# Altium project CPUpipoqueira.PrjPcb
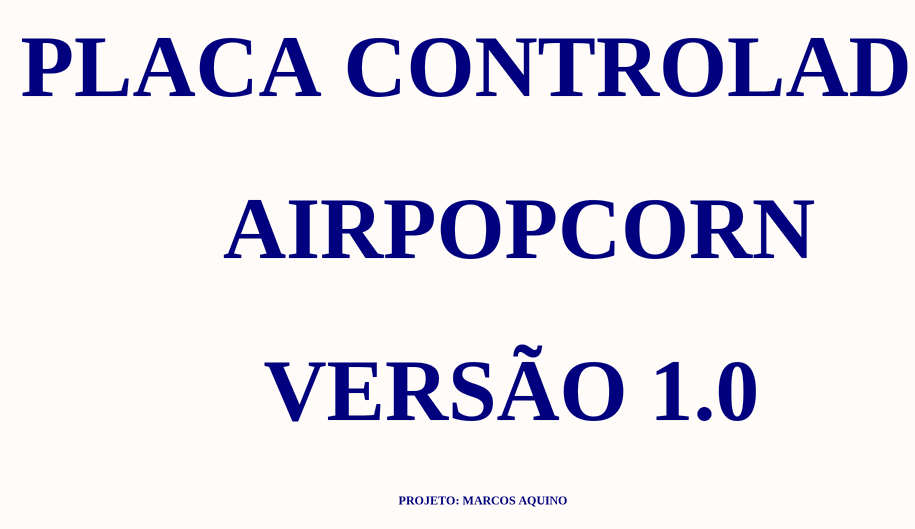
[diagram p0: Capa.SchDoc]
15 sheets, 187 parts. Net scope: global (net labels, ports and power ports of the same name join across sheets).
Board file: CPUpipoqueira.PcbDoc
Sheets:
  Capa.SchDoc
  Regulador.SchDoc
  ControleLeds.SchDoc
  SaidasMotoresCC.SchDoc
  InterfaceConfiguracao.SchDoc
  IHM.SchDoc
  amplificadorAudio.SchDoc
  EntradaSensores.SchDoc
  EntradaSensorTemperatura.SchDoc
  ControlePotencia.SchDoc
  CPU.SchDoc
  Memoria.SchDoc
  JTAG.SchDoc
  InterfaceGSM.SchDoc
  InterfacePagamentos.SchDoc

## Sheet Capa.SchDoc
size A3; DocumentNumber: 1; SheetNumber: 1; SheetTotal: 15

### Notes on the sheet
- PLACA CONTROLADORA
- AIRPOPCORN
- VERSÃO 1.0
- PROJETO: MARCOS AQUINO

## Sheet Regulador.SchDoc: CONTROLADORA AIRPOPCORN
size A3; DocumentNumber: 2; SheetNumber: 2; SheetTotal: 15
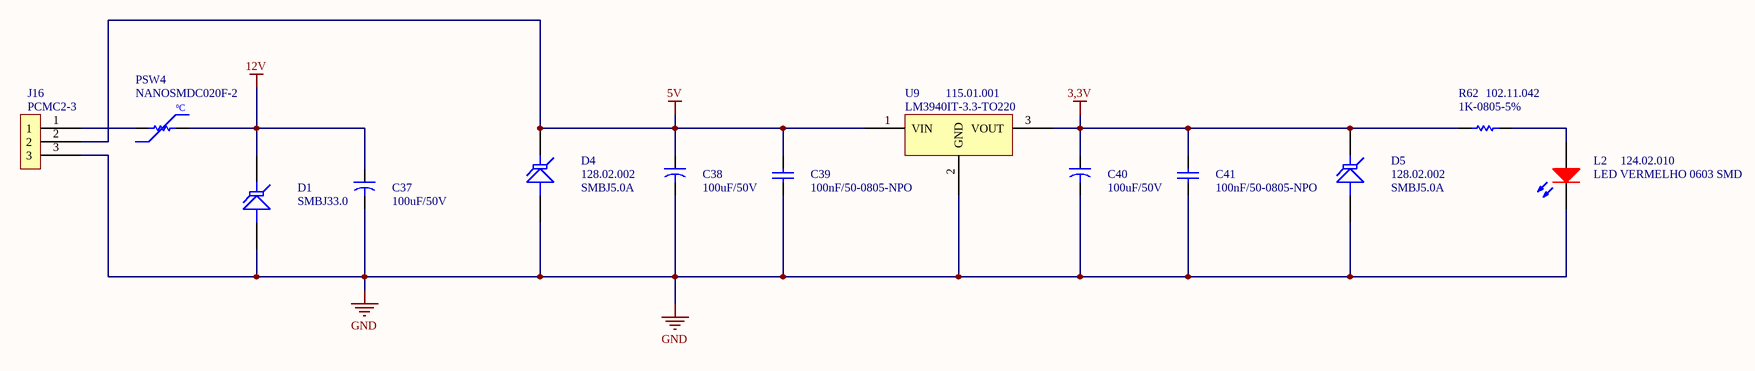
[diagram p1: Regulador.SchDoc]

### Parts
C37  100uF/50V  [CAP POL 8x12mm]
C38  100uF/50V  [CAP POL 8x12mm]
C39  100nF/50-0805-NPO  [0805-REVISADO ONDA]
C40  100uF/50V  [CAP POL 8x12mm]
C41  100nF/50-0805-NPO  [0805-REVISADO ONDA]
D1  SMBJ33.0  [SMB/DO214AA-REVISADO ONDA]
D4  SMBJ5.0A  ERP: 128.02.002  [SMB/DO214AA-REVISADO ONDA]
D5  SMBJ5.0A  ERP: 128.02.002  [SMB/DO214AA-REVISADO ONDA]
J16  PCMC2-3  [CONECTOR HYLOCK 3 VIAS]
L2  LED VERMELHO 0603 SMD  ERP: 124.02.010  [LED 0805 - REVISADO ONDA]
PSW4  NANOSMDC020F-2  [1206-REVISADO ONDA]
R62  1K-0805-5%  ERP: 102.11.042  [0805-REVISADO ONDA]
U9  LM3940IT-3.3-TO220  ERP: 115.01.001  [TO-263]

### Nets
3,3V: C40.1 C41.2 D5.2(K) R62.1 U9.3(VOUT)
5V: C38.1 C39.2 D4.2(K) J16.2 U9.1(VIN)
12V: C37.1 D1.2(K) PSW4.2
GND: C37.2 C38.2 C39.1 C40.2 C41.1 D1.1(A) D4.1(A) D5.1(A) J16.3 L2.2(K) U9.2(GND)
NetJ16_1: J16.1 PSW4.1
NetL2_1: L2.1(A) R62.2

### Notes on the sheet
- NOME
- DATA
- PROJETO
- DESCRIÇÃO
- desenho
- verif.
- aprov.
- TAMANHO
- CODIGO
- Todas as informações disponíveis
- não devem ser divulgadas,
- em parte ou todo.
- CIRCUITO IMPRESSO
- MONTAGEM ELETRÔNICA
- A4
- de
- (in symbol POLYSWITCH 200mA) ºC

### Library data of the parts
D1 = SMBJ5.0A: ERP: 128.02.002
PSW4 = POLYSWITCH 200mA: ERP: 128.12.002
C37 C38 C40 = 100uF/50V: ERP: 105.01.003
C39 C41 = 100nF/50-0805-NPO: ERP: 104.11.005

## Sheet ControleLeds.SchDoc: CONTROLADORA AIRPOPCORN
size A3; DocumentNumber: 3; SheetNumber: 3; SheetTotal: 15
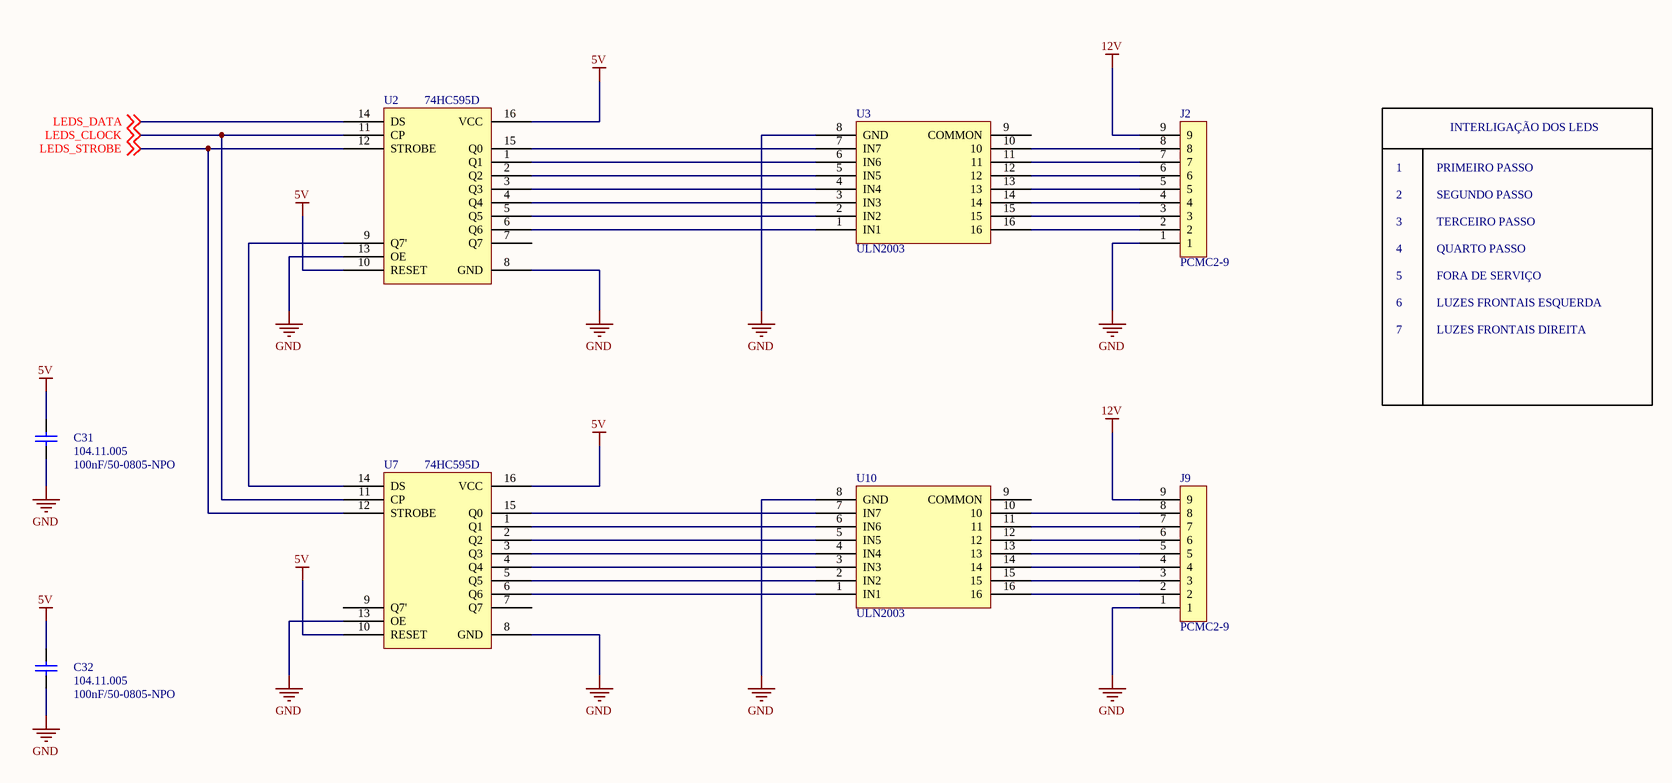
[diagram p2: ControleLeds.SchDoc]

### Parts
C31  100nF/50-0805-NPO  ERP: 104.11.005  [0805-REVISADO ONDA]
C32  100nF/50-0805-NPO  ERP: 104.11.005  [0805-REVISADO ONDA]
J2  PCMC2-9  [PCMC2-9]
J9  PCMC2-9  [PCMC2-9]
U2  74HC595D  [SOIC 16 PINOS]
U3  ULN2003  [SOIC 16 PINOS]
U7  74HC595D  [SOIC 16 PINOS]
U10  ULN2003  [SOIC 16 PINOS]

### Nets
5V: C31.2 C32.2 U2.10(RESET) U2.16(VCC) U7.10(RESET) U7.16(VCC)
12V: J2.9 J9.9
GND: C31.1 C32.1 J2.1 J9.1 U2.8(GND) U2.13(OE) U3.8(GND) U7.8(GND) U7.13(OE) U10.8(GND)
LEDS_CLOCK: U2.11(CP) U7.11(CP) ; off-sheet LEDS_CLOCK
LEDS_DATA: U2.14(DS) ; off-sheet LEDS_DATA
LEDS_STROBE: U2.12(STROBE) U7.12(STROBE) ; off-sheet LEDS_STROBE
NetJ2_2: J2.2 U3.16
NetJ2_3: J2.3 U3.15
NetJ2_4: J2.4 U3.14
NetJ2_5: J2.5 U3.13
NetJ2_6: J2.6 U3.12
NetJ2_7: J2.7 U3.11
NetJ2_8: J2.8 U3.10
NetJ9_2: J9.2 U10.16
NetJ9_3: J9.3 U10.15
NetJ9_4: J9.4 U10.14
NetJ9_5: J9.5 U10.13
NetJ9_6: J9.6 U10.12
NetJ9_7: J9.7 U10.11
NetJ9_8: J9.8 U10.10
NetU2_1: U2.1(Q1) U3.6(IN6)
NetU2_2: U2.2(Q2) U3.5(IN5)
NetU2_3: U2.3(Q3) U3.4(IN4)
NetU2_4: U2.4(Q4) U3.3(IN3)
NetU2_5: U2.5(Q5) U3.2(IN2)
NetU2_6: U2.6(Q6) U3.1(IN1)
NetU2_9: U2.9(Q7') U7.14(DS)
NetU2_15: U2.15(Q0) U3.7(IN7)
NetU7_1: U7.1(Q1) U10.6(IN6)
NetU7_2: U7.2(Q2) U10.5(IN5)
NetU7_3: U7.3(Q3) U10.4(IN4)
NetU7_4: U7.4(Q4) U10.3(IN3)
NetU7_5: U7.5(Q5) U10.2(IN2)
NetU7_6: U7.6(Q6) U10.1(IN1)
NetU7_15: U7.15(Q0) U10.7(IN7)

Not connected (* = marked no-connect by the designer): U2 7(Q7); U3 9(COMMON); U7 7(Q7) 9(Q7'); U10 9(COMMON)

### Notes on the sheet
- INTERLIGAÇÃO DOS LEDS
- 1
- 2
- 3
- PRIMEIRO PASSO
- SEGUNDO PASSO
- TERCEIRO PASSO
- 4
- 5
- QUARTO PASSO
- FORA DE SERVIÇO
- 6
- 7
- LUZES FRONTAIS ESQUERDA
- LUZES FRONTAIS DIREITA
- NOME
- DATA
- PROJETO
- DESCRIÇÃO
- desenho
- verif.
- aprov.
- TAMANHO
- CODIGO
- Todas as informações disponíveis
- não devem ser divulgadas,
- em parte ou todo.
- CIRCUITO IMPRESSO
- MONTAGEM ELETRÔNICA
- A4
- de

### Library data of the parts
U2 U7 = 74HC595D: ERP: CADASTRAR

## Sheet SaidasMotoresCC.SchDoc: CONTROLADORA AIRPOPCORN
size A3; DocumentNumber: 4; SheetNumber: 4; SheetTotal: 15
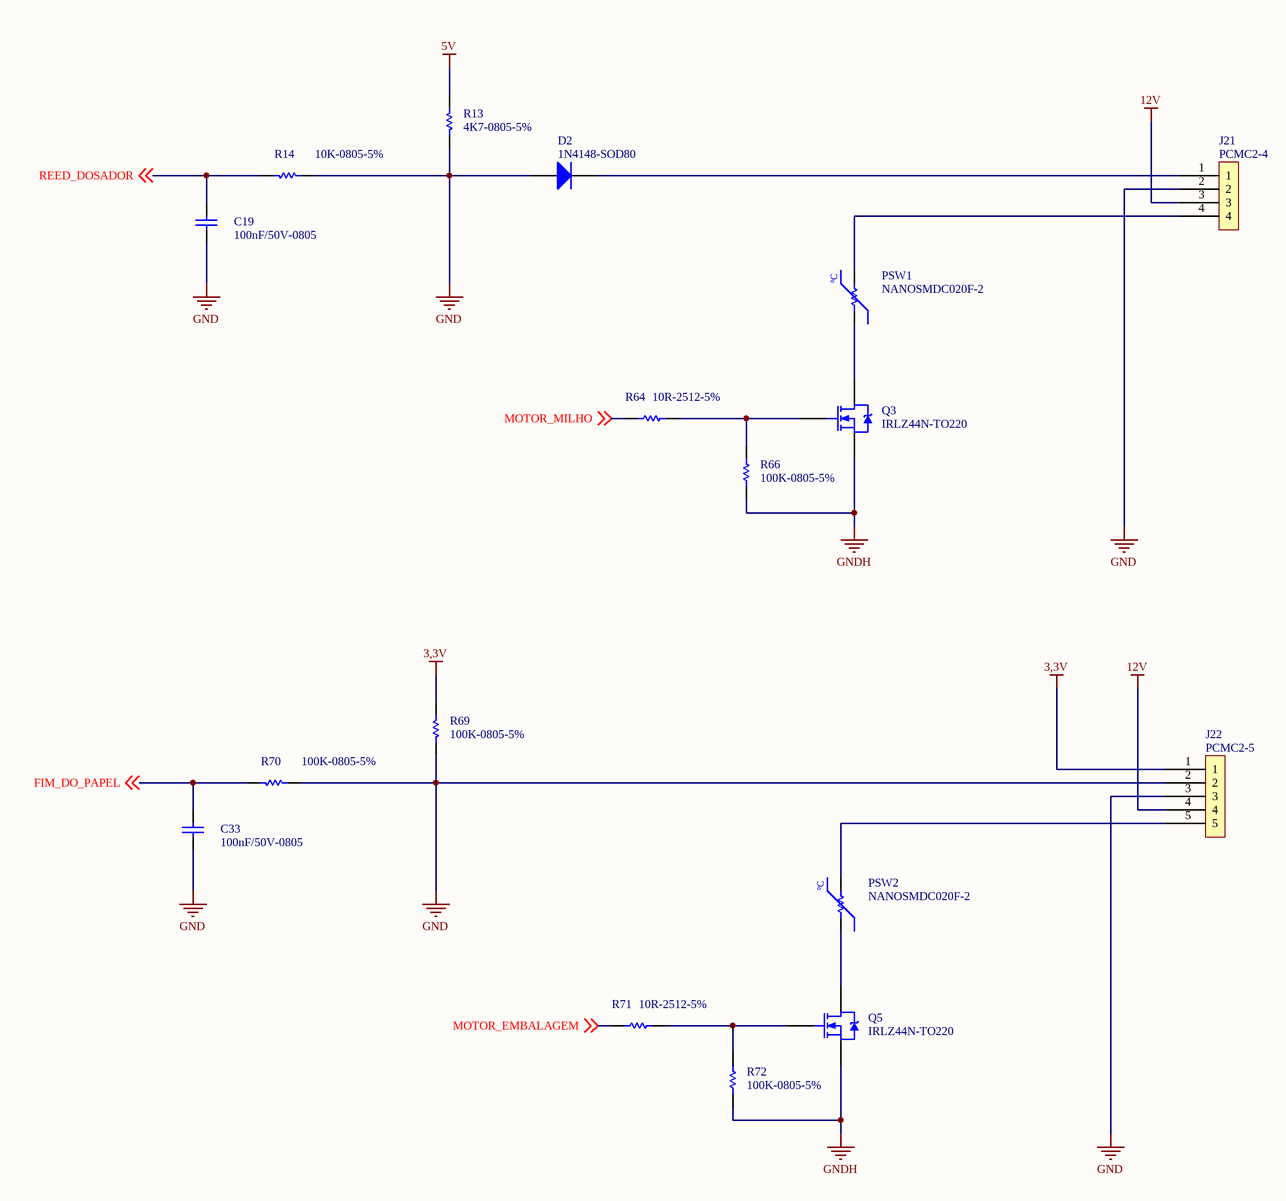
[diagram p3: SaidasMotoresCC.SchDoc]

### Parts
C19  100nF/50V-0805  [0805-REVISADO ONDA]
C33  100nF/50V-0805  [0805-REVISADO ONDA]
D2  1N4148-SOD80
J21  PCMC2-4  [PCMC2-4]
J22  PCMC2-5  [PCMC2-5]
PSW1  NANOSMDC020F-2  [2512 - REVISADO ONDA]
PSW2  NANOSMDC020F-2  [2512 - REVISADO ONDA]
Q3  IRLZ44N-TO220  [TO220-3 EM PÉ]
Q5  IRLZ44N-TO220  [TO220-3 EM PÉ]
R13  4K7-0805-5%  [0805-REVISADO ONDA]
R14  10K-0805-5%  [0805-REVISADO ONDA]
R64  10R-2512-5%  [1206-REVISADO ONDA]
R66  100K-0805-5%  [0805-REVISADO ONDA]
R69  100K-0805-5%  [0805-REVISADO ONDA]
R70  100K-0805-5%  [0805-REVISADO ONDA]
R71  10R-2512-5%  [1206-REVISADO ONDA]
R72  100K-0805-5%  [0805-REVISADO ONDA]

### Nets
3,3V: J22.1 R69.2
5V: R13.2
12V: J21.3 J22.4
GND: C19.1 C33.1 D2.1 J21.2 J22.2 J22.3 R13.1 R14.1 R69.1 R70.1
GNDH: Q3.3(S) Q5.3(S) R66.1 R72.1
FIM_DO_PAPEL: C33.2 R70.2 ; off-sheet FIM_DO_PAPEL
MOTOR_EMBALAGEM: R71.2 ; off-sheet MOTOR_EMBALAGEM
MOTOR_MILHO: R64.2 ; off-sheet MOTOR_MILHO
REED_DOSADOR: C19.2 R14.2 ; off-sheet REED_DOSADOR
NetD2_2: D2.2 J21.1
NetJ21_4: J21.4 PSW1.2
NetJ22_5: J22.5 PSW2.2
NetPSW1_1: PSW1.1 Q3.2(D)
NetPSW2_1: PSW2.1 Q5.2(D)
NetQ3_1: Q3.1(G) R64.1 R66.2
NetQ5_1: Q5.1(G) R71.1 R72.2

### Notes on the sheet
- NOME
- DATA
- PROJETO
- DESCRIÇÃO
- desenho
- verif.
- aprov.
- TAMANHO
- CODIGO
- Todas as informações disponíveis
- não devem ser divulgadas,
- em parte ou todo.
- CIRCUITO IMPRESSO
- MONTAGEM ELETRÔNICA
- A4
- de
- (in symbol POLYSWITCH 200mA) ºC

### Library data of the parts
C19 C33 = 100nF/50-0805-NPO: ERP: 104.11.005
PSW1 PSW2 = POLYSWITCH 200mA: ERP: 128.12.002
R13 R69 = 10K-0805-5%: ERP: 102.11.054
R14 R70 = 1K-0805-5%: ERP: 102.11.042
R64 R71 = 100K-0805-5%: ERP: 102.11.066
D2 = 1N4148-SOD80: ERP: 120.19.001
Q3 Q5 = IRLZ44N-TO220: ERP: 107.01.006
R66 R72 = 100K-0805-5%: ERP: 102.11.066

## Sheet InterfaceConfiguracao.SchDoc: CONTROLADORA AIRPOPCORN
size A3; DocumentNumber: 5; SheetNumber: 5; SheetTotal: 15
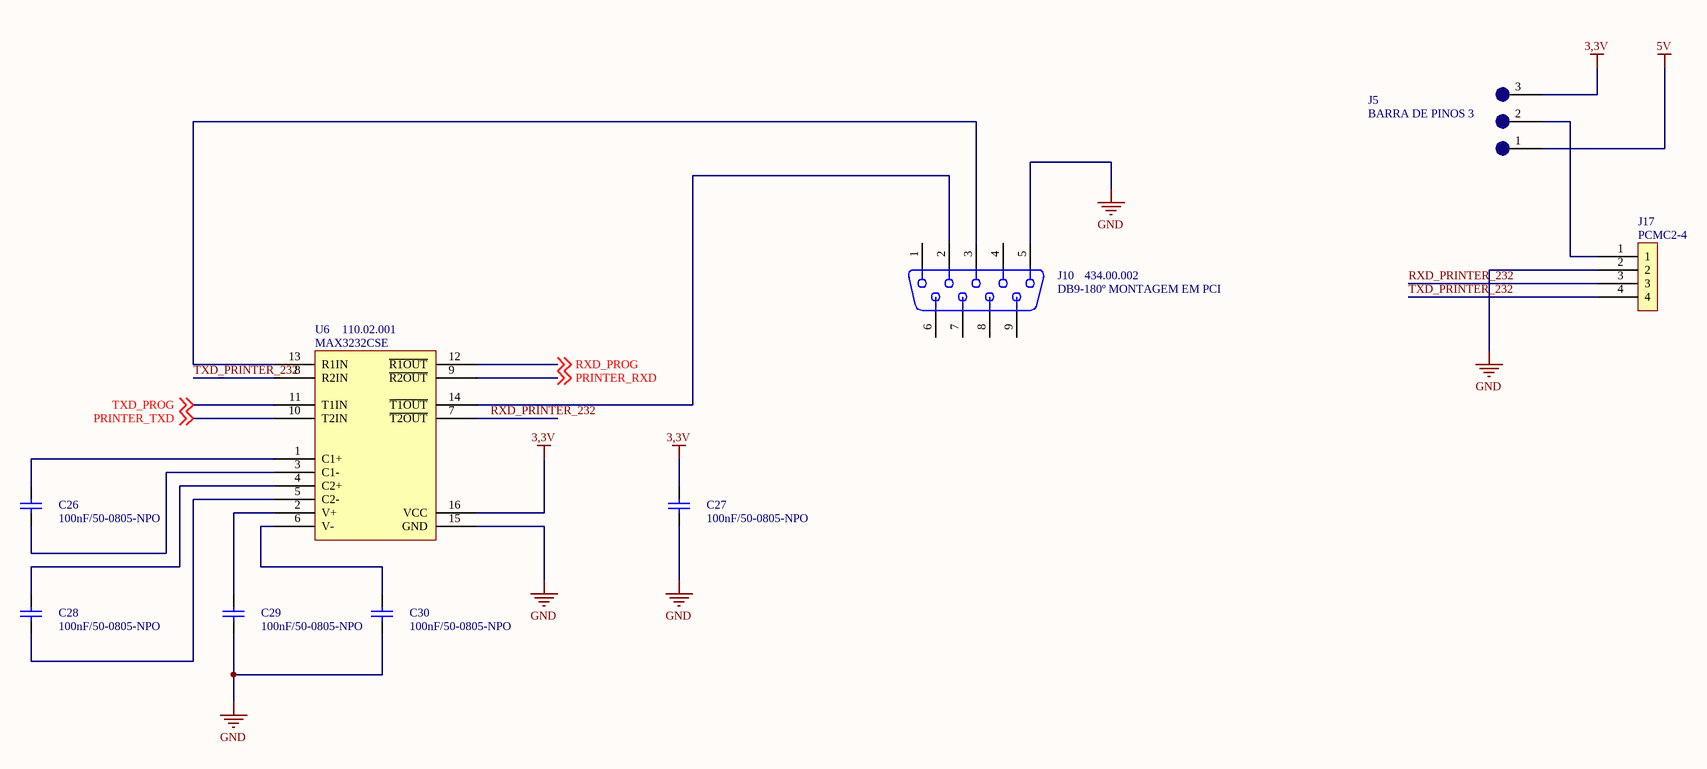
[diagram p4: InterfaceConfiguracao.SchDoc]

### Parts
C26  100nF/50-0805-NPO  [0805-REVISADO ONDA]
C27  100nF/50-0805-NPO  [0805-REVISADO ONDA]
C28  100nF/50-0805-NPO  [0805-REVISADO ONDA]
C29  100nF/50-0805-NPO  [0805-REVISADO ONDA]
C30  100nF/50-0805-NPO  [0805-REVISADO ONDA]
J5  BARRA DE PINOS 3  [JUMPO 3 VIAS]
J10  DB9-180º MONTAGEM EM PCI  ERP: 434.00.002  [DB9-FÊMEA MONTAGEM EM PCI 180]
J17  PCMC2-4  [PCMC2-4]
U6  MAX3232CSE  ERP: 110.02.001  [SOIC 16 PINOS]

### Nets
3,3V: C27.2 J5.3 U6.16(VCC)
5V: J5.1
GND: C27.1 C29.1 C30.1 J10.5 J17.2 U6.15(GND)
PRINTER_RXD: U6.9(~{R2OUT}) ; off-sheet PRINTER_RXD
PRINTER_TXD: U6.10(T2IN) ; off-sheet PRINTER_TXD
RXD_PRINTER_232: J17.3 U6.7(~{T2OUT})
RXD_PROG: U6.12(~{R1OUT}) ; off-sheet RXD_PROG
TXD_PRINTER_232: J17.4 U6.8(R2IN)
TXD_PROG: U6.11(T1IN) ; off-sheet TXD_PROG
NetC26_1: C26.1 U6.3(C1-)
NetC26_2: C26.2 U6.1(C1+)
NetC28_1: C28.1 U6.5(C2-)
NetC28_2: C28.2 U6.4(C2+)
NetC29_2: C29.2 U6.2(V+)
NetC30_2: C30.2 U6.6(V-)
NetJ5_2: J5.2 J17.1
NetJ10_2: J10.2 U6.14(~{T1OUT})
NetJ10_3: J10.3 U6.13(R1IN)

Not connected (* = marked no-connect by the designer): J10 1 4 6 7 8 9

### Notes on the sheet
- NOME
- DATA
- PROJETO
- DESCRIÇÃO
- desenho
- verif.
- aprov.
- TAMANHO
- CODIGO
- Todas as informações disponíveis
- não devem ser divulgadas,
- em parte ou todo.
- CIRCUITO IMPRESSO
- MONTAGEM ELETRÔNICA
- A4
- de

### Library data of the parts
J5 = JUMPER 3
J10 = DB-9 - FÊMEA 180º MONTAGEM EM PCI: DBPCF-09
C26-C30 = 100nF/50-0805-NPO: ERP: 104.11.005

## Sheet IHM.SchDoc: CONTROLADORA AIRPOPCORN
size A3; DocumentNumber: 6; SheetNumber: 6; SheetTotal: 15
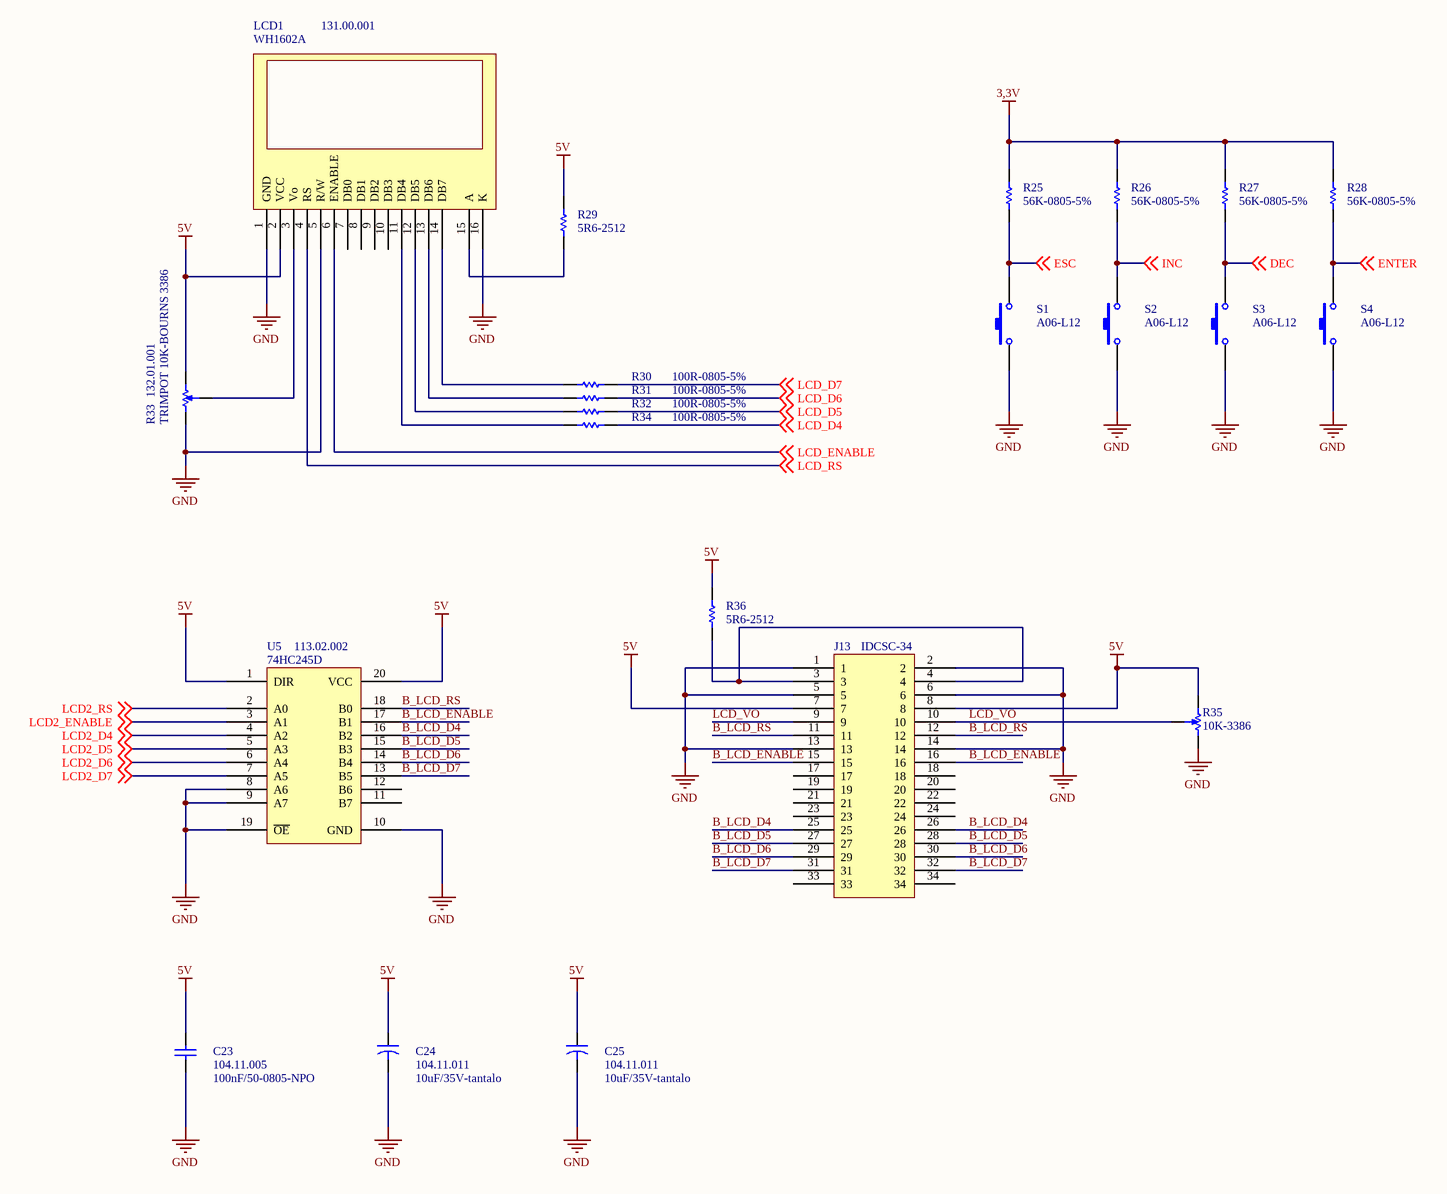
[diagram p5: IHM.SchDoc]

### Parts
C23  100nF/50-0805-NPO  ERP: 104.11.005  [0805-REVISADO ONDA]
C24  10uF/35V-tantalo  ERP: 104.11.011  [CAP 2413 POLARIZADO KEMET]
C25  10uF/35V-tantalo  ERP: 104.11.011  [CAP 2413 POLARIZADO KEMET]
J13  IDCSC-34  [IDCSC-34]
LCD1  WH1602A  ERP: 131.00.001  [WH1602]
R25  56K-0805-5%  [0805-REVISADO ONDA]
R26  56K-0805-5%  [0805-REVISADO ONDA]
R27  56K-0805-5%  [0805-REVISADO ONDA]
R28  56K-0805-5%  [0805-REVISADO ONDA]
R29  5R6-2512  [2512 - REVISADO ONDA]
R30  100R-0805-5%  [0805-revisado onda]
R31  100R-0805-5%  [0805-REVISADO ONDA]
R32  100R-0805-5%  [0805-REVISADO ONDA]
R33  TRIMPOT 10K-BOURNS 3386  ERP: 132.01.001  [TRIMPOT 3386]
R34  100R-0805-5%  [0805-REVISADO ONDA]
R35  10K-3386  [TRIMPOT 3386]
R36  5R6-2512  [2512 - REVISADO ONDA]
S1  A06-L12  [chave tactil nova]
S2  A06-L12  [chave tactil nova]
S3  A06-L12  [chave tactil nova]
S4  A06-L12  [chave tactil nova]
U5  74HC245D  ERP: 113.02.002  [SOIC 20 FEITO A MÃO]

### Nets
3,3V: R25.1 R26.1 R27.1 R28.1
5V: C23.2 C24.1 C25.1 J13.7 J13.8 LCD1.2(VCC) R29.2 R33.1 R35.3 R36.2 U5.1(DIR) U5.20(VCC)
GND: C23.1 C24.2 C25.2 J13.1 J13.2 J13.5 J13.6 J13.13 J13.14 LCD1.1(GND) LCD1.5(R/W) LCD1.16(K) R33.3 R35.1 S1.1 S2.1 S3.1 S4.1 U5.8(A6) U5.9(A7) U5.10(GND) U5.19(~{OE})
B_LCD_D4: J13.25 J13.26 U5.16(B2)
B_LCD_D5: J13.27 J13.28 U5.15(B3)
B_LCD_D6: J13.29 J13.30 U5.14(B4)
B_LCD_D7: J13.31 J13.32 U5.13(B5)
B_LCD_ENABLE: J13.15 J13.16 U5.17(B1)
B_LCD_RS: J13.11 J13.12 U5.18(B0)
DEC: R27.2 S3.2 ; off-sheet DEC
ENTER: R28.2 S4.2 ; off-sheet ENTER
ESC: R25.2 S1.2 ; off-sheet ESC
INC: R26.2 S2.2 ; off-sheet INC
LCD2_D4: U5.4(A2) ; off-sheet LCD2_D4
LCD2_D5: U5.5(A3) ; off-sheet LCD2_D5
LCD2_D6: U5.6(A4) ; off-sheet LCD2_D6
LCD2_D7: U5.7(A5) ; off-sheet LCD2_D7
LCD2_ENABLE: U5.3(A1) ; off-sheet LCD2_ENABLE
LCD2_RS: U5.2(A0) ; off-sheet LCD2_RS
LCD_D4: R34.2 ; off-sheet LCD_D4
LCD_D5: R32.2 ; off-sheet LCD_D5
LCD_D6: R31.2 ; off-sheet LCD_D6
LCD_D7: R30.2 ; off-sheet LCD_D7
LCD_ENABLE: LCD1.6(ENABLE) ; off-sheet LCD_ENABLE
LCD_RS: LCD1.4(RS) ; off-sheet LCD_RS
LCD_VO: J13.9 J13.10 R35.2
NetJ13_3: J13.3 J13.4 R36.1
NetLCD1_3: LCD1.3(Vo) R33.2
NetLCD1_11: LCD1.11(DB4) R34.1
NetLCD1_12: LCD1.12(DB5) R32.1
NetLCD1_13: LCD1.13(DB6) R31.1
NetLCD1_14: LCD1.14(DB7) R30.1
NetLCD1_15: LCD1.15(A) R29.1

Not connected (* = marked no-connect by the designer): J13 17 18 19 20 21 22 23 24 33 34; LCD1 7(DB0) 8(DB1) 9(DB2) 10(DB3); U5 11(B7) 12(B6)

### Notes on the sheet
- NOME
- DATA
- PROJETO
- DESCRIÇÃO
- desenho
- verif.
- aprov.
- TAMANHO
- CODIGO
- Todas as informações disponíveis
- não devem ser divulgadas,
- em parte ou todo.
- CIRCUITO IMPRESSO
- MONTAGEM ELETRÔNICA
- A4
- de

### Library data of the parts
R29 R36 = RES 5R6-CR100: 5R6-CR100; ERP: 103.05.016
R33 = TRIMPOT 3386 50K
R35 = TRIMPOT 10K-3386: TRIMPOT 100K-0805-5%; ERP: 132.01.001
R25-R28 = 56K-0805-5%: ERP: 102.11.063
R30-R32 R34 = 100R-0805-5%: ERP: 102.11.031
S1-S4 = A06-L12: ERP: 136.00.001

## Sheet amplificadorAudio.SchDoc: CONTROLADORA AIRPOPCORN
size A3; DocumentNumber: 7; SheetNumber: 7; SheetTotal: 15
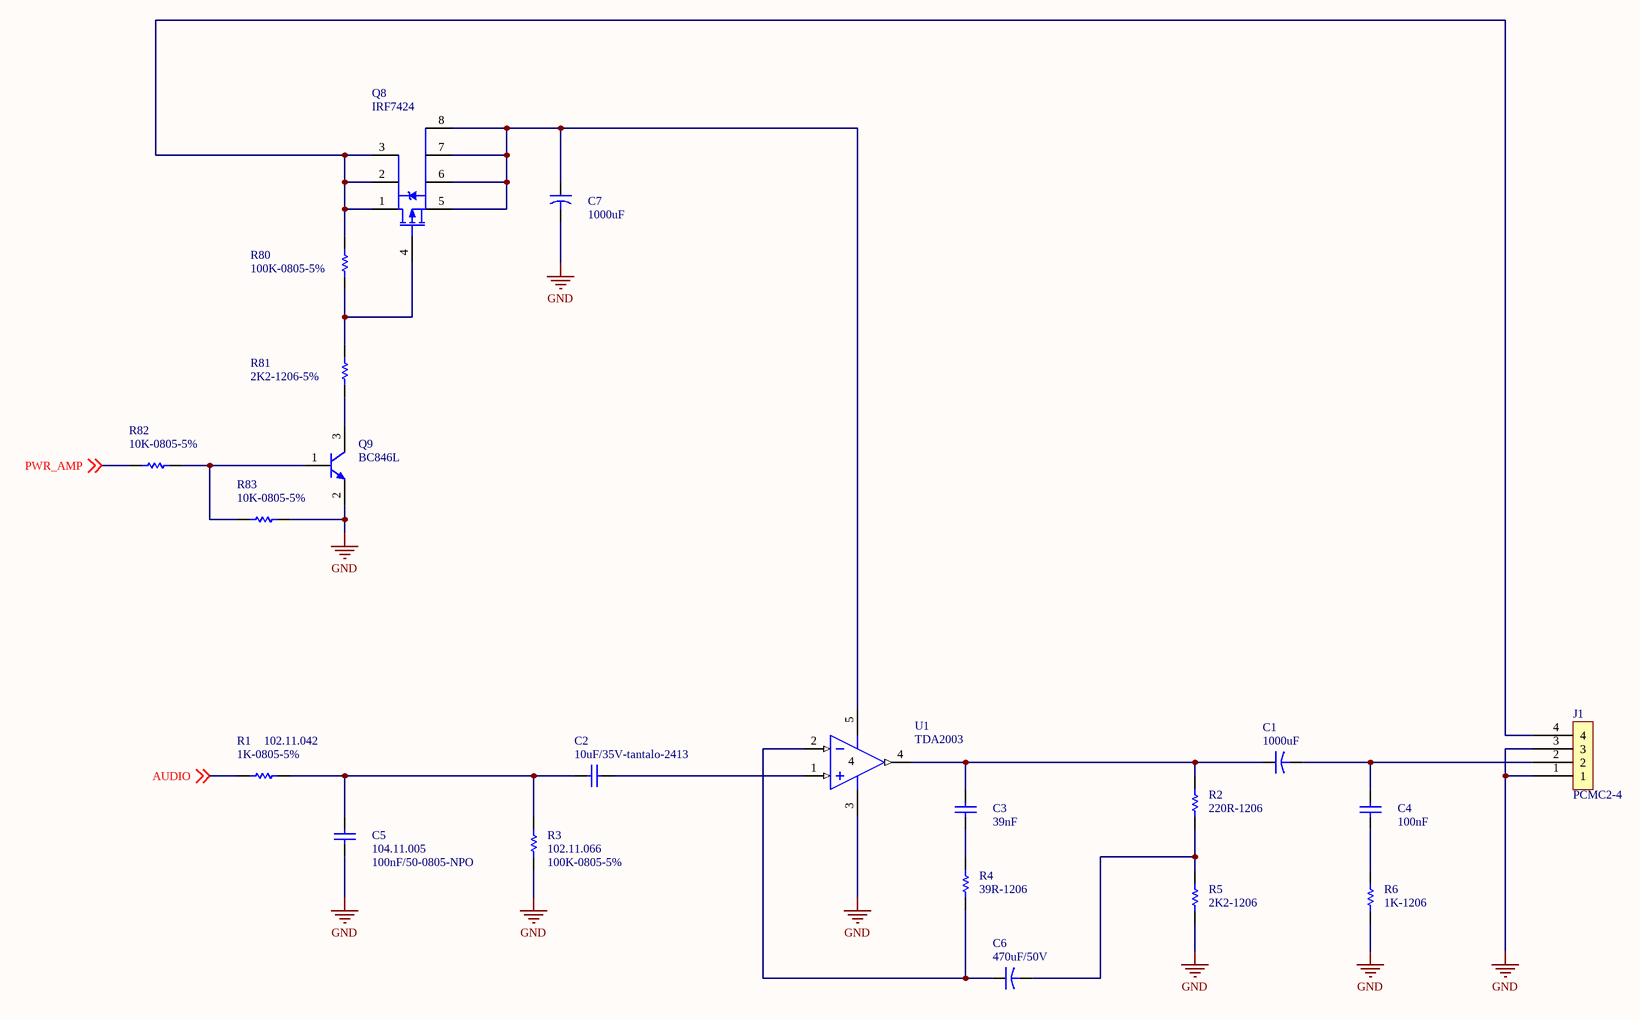
[diagram p6: amplificadorAudio.SchDoc]

### Parts
C1  1000uF  [CAP 10X5]
C2  10uF/35V-tantalo-2413  [CAP POL 5x11mm]
C3  39nF  [1206-REVISADO ONDA]
C4  100nF  [1206-REVISADO ONDA]
C5  100nF/50-0805-NPO  ERP: 104.11.005  [0805-REVISADO ONDA]
C6  470uF/50V  [CAP 10X5]
C7  1000uF  [CAP 10X5]
J1  PCMC2-4  [PCMC2-4]
Q8  IRF7424  [SOIC-08]
Q9  BC846L  [SOT23 - REVISADO ONDA]
R1  1K-0805-5%  ERP: 102.11.042  [0805-REVISADO ONDA]
R2  220R-1206  [1206-REVISADO ONDA]
R3  100K-0805-5%  ERP: 102.11.066  [0805-REVISADO ONDA]
R4  39R-1206  [1206-REVISADO ONDA]
R5  2K2-1206  [1206-REVISADO ONDA]
R6  1K-1206  [1206-REVISADO ONDA]
R80  100K-0805-5%  [0805-REVISADO ONDA]
R81  2K2-1206-5%  [1206-REVISADO ONDA]
R82  10K-0805-5%  [0805-REVISADO ONDA]
R83  10K-0805-5%  [0805-REVISADO ONDA]
U1  TDA2003  [PENTAWATT V]

### Nets
GND: C5.1 C7.2 J1.1 J1.3 Q9.2(E) R3.1 R5.2 R6.2 R83.2 U1.3(GND)
AUDIO: R1.1 ; off-sheet AUDIO
PWR_AMP: R82.1 ; off-sheet PWR_AMP
NetC1_1: C1.1 C3.2 R2.1 U1.4(OUT)
NetC1_2: C1.2 C4.2 J1.2
NetC2_1: C2.1 C5.2 R1.2 R3.2
NetC2_2: C2.2 U1.1(IN+)
NetC3_1: C3.1 R4.1
NetC4_1: C4.1 R6.1
NetC6_1: C6.1 R4.2 U1.2(IN-)
NetC6_2: C6.2 R2.2 R5.1
NetC7_1: C7.1 Q8.5(D2) Q8.6(D2) Q8.7(D2) Q8.8(D2) U1.5(V+)
NetJ1_4: J1.4 Q8.1(S2) Q8.2(S2) Q8.3(S2) R80.2
NetQ8_4: Q8.4(G2) R80.1 R81.2
NetQ9_1: Q9.1(B) R82.2 R83.1
NetQ9_3: Q9.3(C) R81.1

### Notes on the sheet
- NOME
- DATA
- PROJETO
- DESCRIÇÃO
- desenho
- verif.
- aprov.
- TAMANHO
- CODIGO
- Todas as informações disponíveis
- não devem ser divulgadas,
- em parte ou todo.
- CIRCUITO IMPRESSO
- MONTAGEM ELETRÔNICA
- A4
- de

### Library data of the parts
C1 C7 = 470uF/50V: ERP: 105.01.005
C3 C4 = 100nF/50-0805-NPO: ERP: 104.11.005
Q9 = BC846: ERP: 106.22.001
R2 R4-R6 = 390R-2512-5%: ERP: 102.31.002
C6 = 470uF/50V: ERP: 105.01.005
Q8 = IRF7424: ERP: 107.01.012
R3 R80 = 100K-0805-5%
  R80: ERP: 102.11.066
R82 R83 = 10K-0805-5%: ERP: 102.11.054

## Sheet EntradaSensores.SchDoc: CONTROLADORA AIRPOPCORN
size A3; DocumentNumber: 8; SheetNumber: 8; SheetTotal: 15
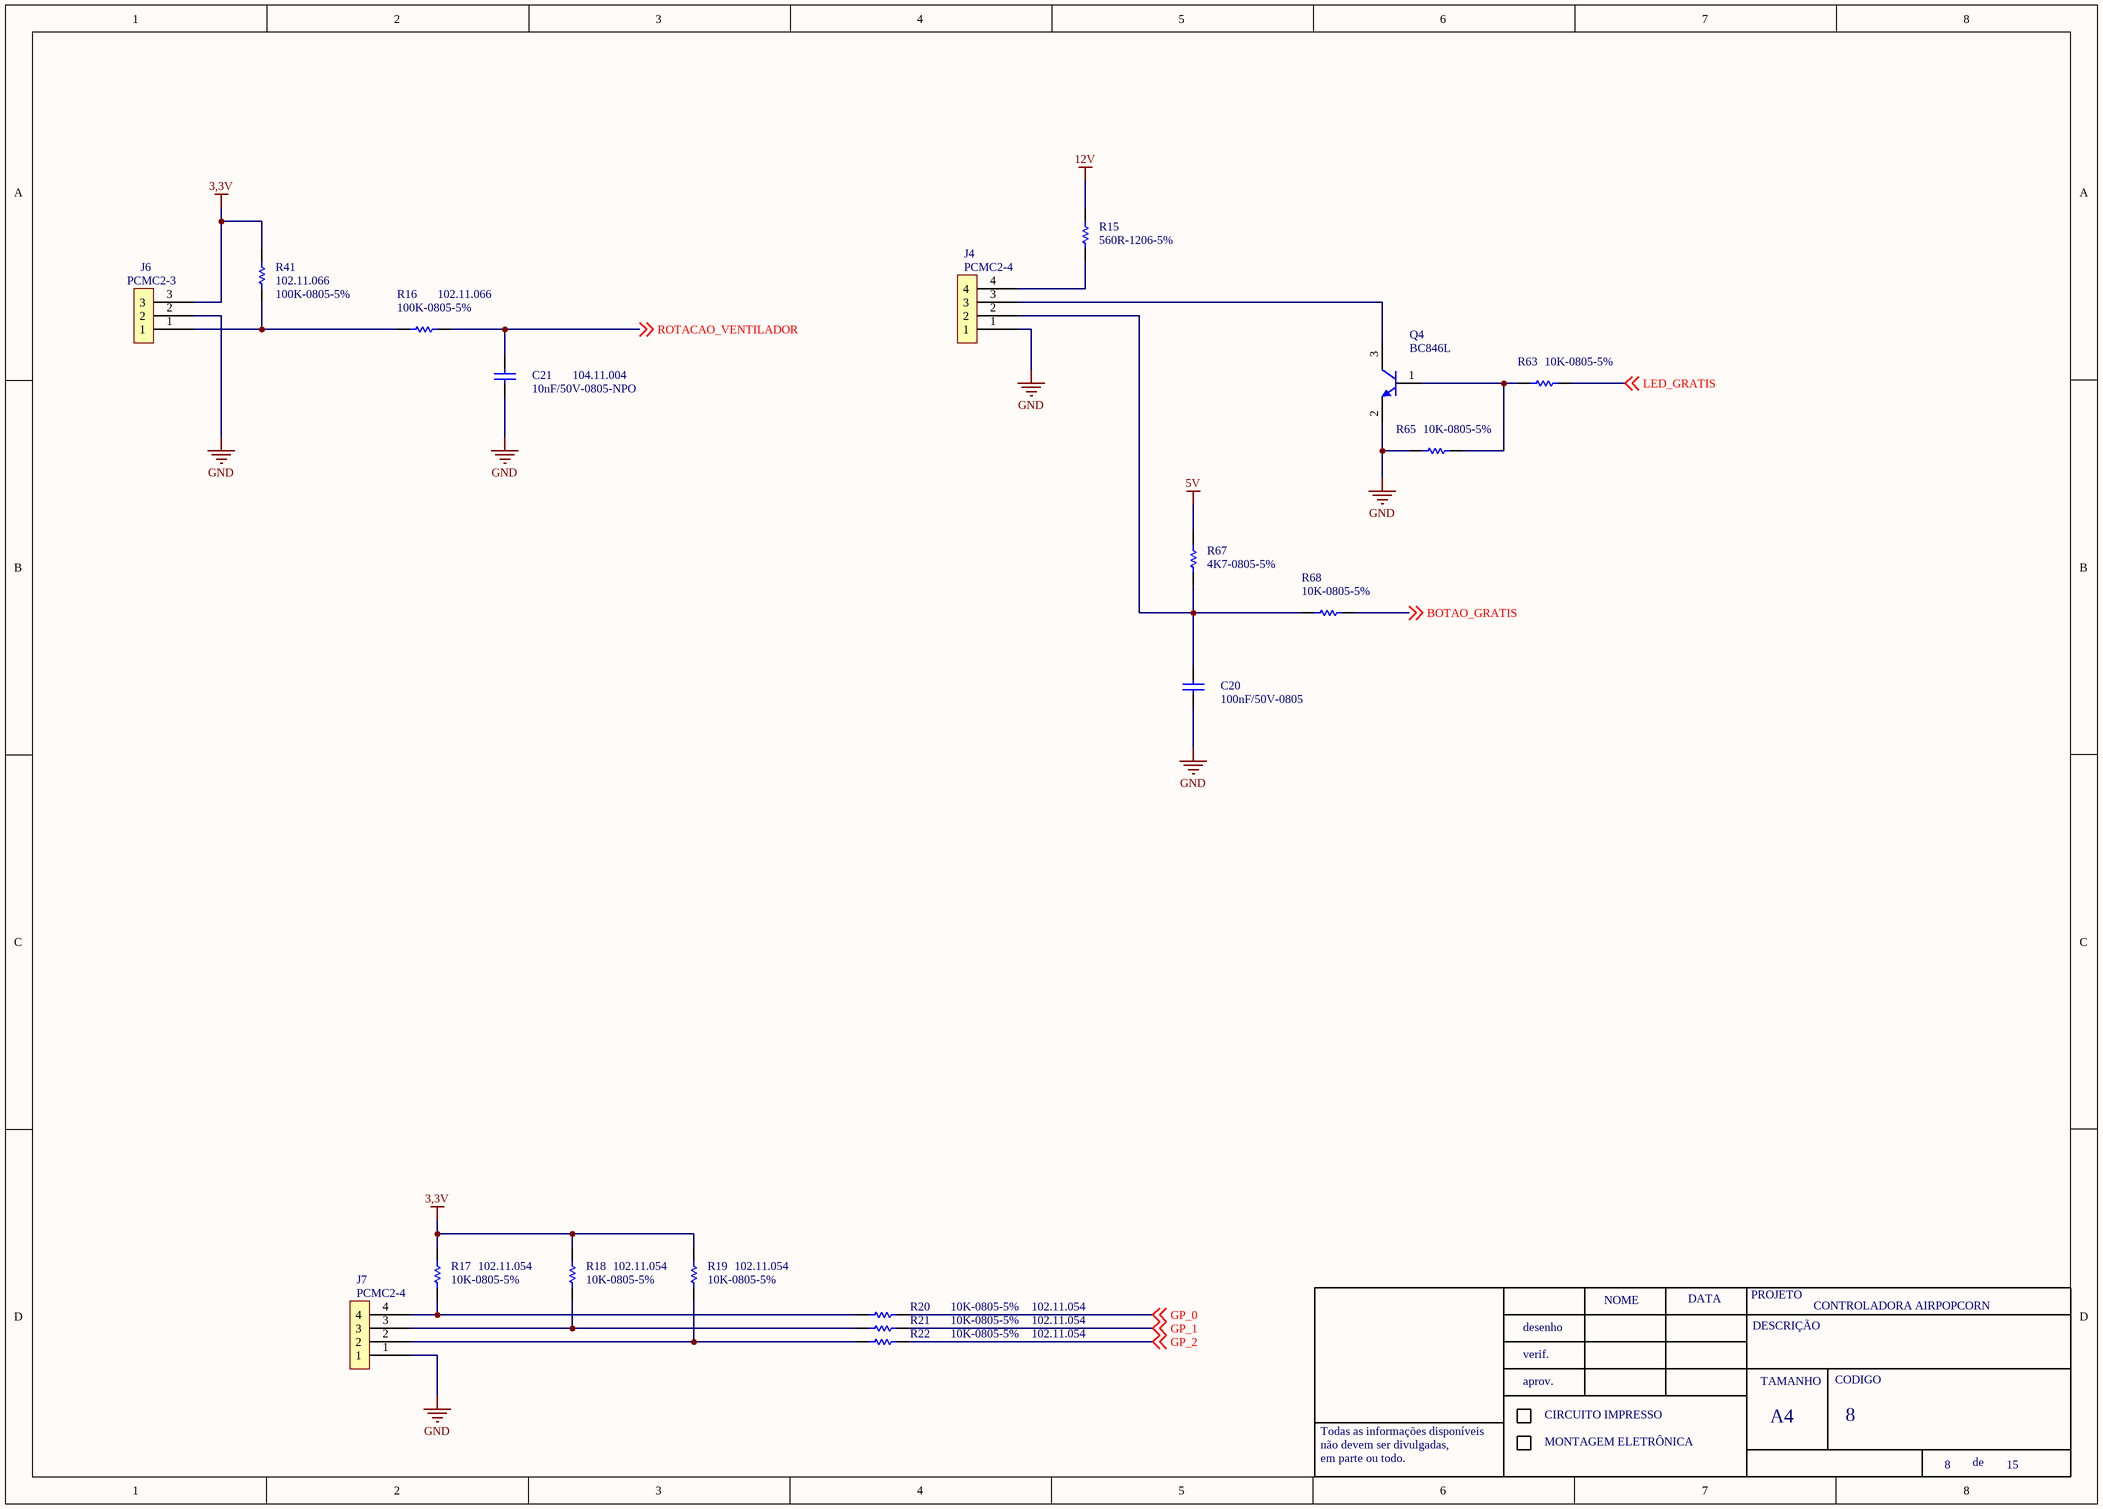
[diagram p7: EntradaSensores.SchDoc]

### Parts
C20  100nF/50V-0805
C21  10nF/50V-0805-NPO  ERP: 104.11.004  [0805-REVISADO ONDA]
J4  PCMC2-4  [PCMC2-4]
J6  PCMC2-3  [PCMC2-3]
J7  PCMC2-4  [PCMC2-4]
Q4  BC846L
R15  560R-1206-5%
R16  100K-0805-5%  ERP: 102.11.066  [0805-REVISADO ONDA]
R17  10K-0805-5%  ERP: 102.11.054  [0805-REVISADO ONDA]
R18  10K-0805-5%  ERP: 102.11.054  [0805-REVISADO ONDA]
R19  10K-0805-5%  ERP: 102.11.054  [0805-REVISADO ONDA]
R20  10K-0805-5%  ERP: 102.11.054  [0805-REVISADO ONDA]
R21  10K-0805-5%  ERP: 102.11.054  [0805-REVISADO ONDA]
R22  10K-0805-5%  ERP: 102.11.054  [0805-REVISADO ONDA]
R41  100K-0805-5%  ERP: 102.11.066  [0805-REVISADO ONDA]
R63  10K-0805-5%
R65  10K-0805-5%
R67  4K7-0805-5%
R68  10K-0805-5%

### Nets
3,3V: J6.3 R17.2 R18.2 R19.2 R41.2
5V: R67.2
12V: R15.1
GND: C20.1 C21.1 J4.1 J6.2 J7.1 Q4.2(E) R65.1
BOTAO_GRATIS: R68.1 ; off-sheet BOTAO_GRATIS
GP_0: R20.2 ; off-sheet GP_0
GP_1: R21.2 ; off-sheet GP_1
GP_2: R22.2 ; off-sheet GP_2
LED_GRATIS: R63.2 ; off-sheet LED_GRATIS
ROTACAO_VENTILADOR: C21.2 R16.2 ; off-sheet ROTACAO_VENTILADOR
NetC20_2: C20.2 J4.2 R67.1 R68.2
NetJ4_3: J4.3 Q4.3(C)
NetJ4_4: J4.4 R15.2
NetJ6_1: J6.1 R16.1 R41.1
NetJ7_2: J7.2 R19.1 R22.1
NetJ7_3: J7.3 R18.1 R21.1
NetJ7_4: J7.4 R17.1 R20.1
NetQ4_1: Q4.1(B) R63.1 R65.2

### Notes on the sheet
- NOME
- DATA
- PROJETO
- DESCRIÇÃO
- desenho
- verif.
- aprov.
- TAMANHO
- CODIGO
- Todas as informações disponíveis
- não devem ser divulgadas,
- em parte ou todo.
- CIRCUITO IMPRESSO
- MONTAGEM ELETRÔNICA
- A4
- de

### Library data of the parts
C20 = 100nF/50-0805-NPO: ERP: 104.11.005
Q4 = BC846: ERP: 106.22.001
R15 = 1K2-0805-1%: ERP: 102.11.106
R67 = 4K7-1206-5%: ERP: 102.12.050
R17-R22 R63 R65 R68 = 10K-0805-5%
  R63 R65 R68: ERP: 102.11.054

## Sheet EntradaSensorTemperatura.SchDoc: CONTROLADORA AIRPOPCORN
size A3; DocumentNumber: 9; SheetNumber: 9; SheetTotal: 15
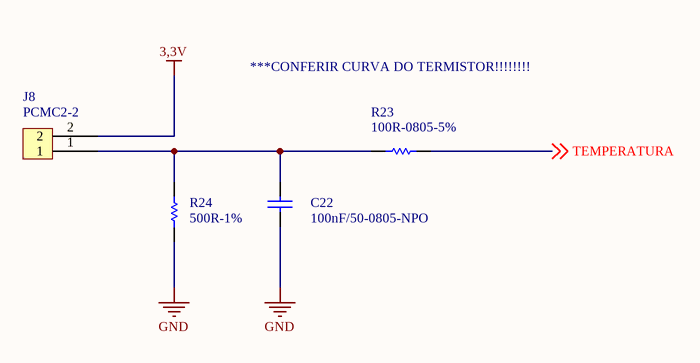
[diagram p8: EntradaSensorTemperatura.SchDoc]

### Parts
C22  100nF/50-0805-NPO  [0805-REVISADO ONDA]
J8  PCMC2-2  [PCMC2-2]
R23  100R-0805-5%  [0805-REVISADO ONDA]
R24  500R-1%  [0805-REVISADO ONDA]

### Nets
3,3V: J8.2
GND: C22.1 R24.1
TEMPERATURA: R23.2 ; off-sheet TEMPERATURA
NetC22_2: C22.2 J8.1 R23.1 R24.2

### Notes on the sheet
- ***CONFERIR CURVA DO TERMISTOR!!!!!!!!
- NOME
- DATA
- PROJETO
- DESCRIÇÃO
- desenho
- verif.
- aprov.
- TAMANHO
- CODIGO
- Todas as informações disponíveis
- não devem ser divulgadas,
- em parte ou todo.
- CIRCUITO IMPRESSO
- MONTAGEM ELETRÔNICA
- A4
- de

### Library data of the parts
R24 = 10K-0805-5%: ERP: 102.11.054
C22 = 100nF/50-0805-NPO: ERP: 104.11.005
R23 = 100R-0805-5%: ERP: 102.11.031

## Sheet ControlePotencia.SchDoc: CONTROLADORA AIRPOPCORN
size A3; DocumentNumber: 10; SheetNumber: 10; SheetTotal: 15
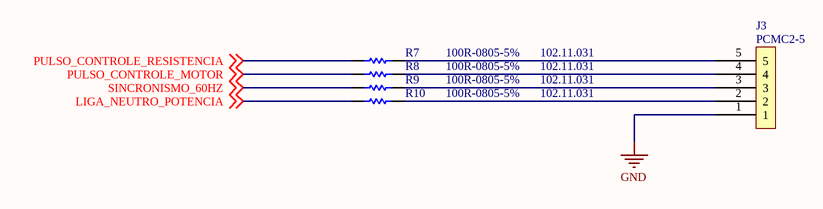
[diagram p9: ControlePotencia.SchDoc]

### Parts
J3  PCMC2-5  [PCMC2-5]
R7  100R-0805-5%  ERP: 102.11.031  [0805-REVISADO ONDA]
R8  100R-0805-5%  ERP: 102.11.031  [0805-REVISADO ONDA]
R9  100R-0805-5%  ERP: 102.11.031  [0805-REVISADO ONDA]
R10  100R-0805-5%  ERP: 102.11.031  [0805-REVISADO ONDA]

### Nets
GND: J3.1
LIGA_NEUTRO_POTENCIA: R10.1 ; off-sheet LIGA_NEUTRO_POTENCIA
PULSO_CONTROLE_MOTOR: R8.1 ; off-sheet PULSO_CONTROLE_MOTOR
PULSO_CONTROLE_RESISTENCIA: R7.1 ; off-sheet PULSO_CONTROLE_RESISTENCIA
SINCRONISMO_60HZ: R9.1 ; off-sheet SINCRONISMO_60HZ
NetJ3_2: J3.2 R10.2
NetJ3_3: J3.3 R9.2
NetJ3_4: J3.4 R8.2
NetJ3_5: J3.5 R7.2

### Notes on the sheet
- NOME
- DATA
- PROJETO
- DESCRIÇÃO
- desenho
- verif.
- aprov.
- TAMANHO
- CODIGO
- Todas as informações disponíveis
- não devem ser divulgadas,
- em parte ou todo.
- CIRCUITO IMPRESSO
- MONTAGEM ELETRÔNICA
- A4
- de

## Sheet CPU.SchDoc: CONTROLADORA AIRPOPCORN
size A3; DocumentNumber: 11; SheetNumber: 11; SheetTotal: 15
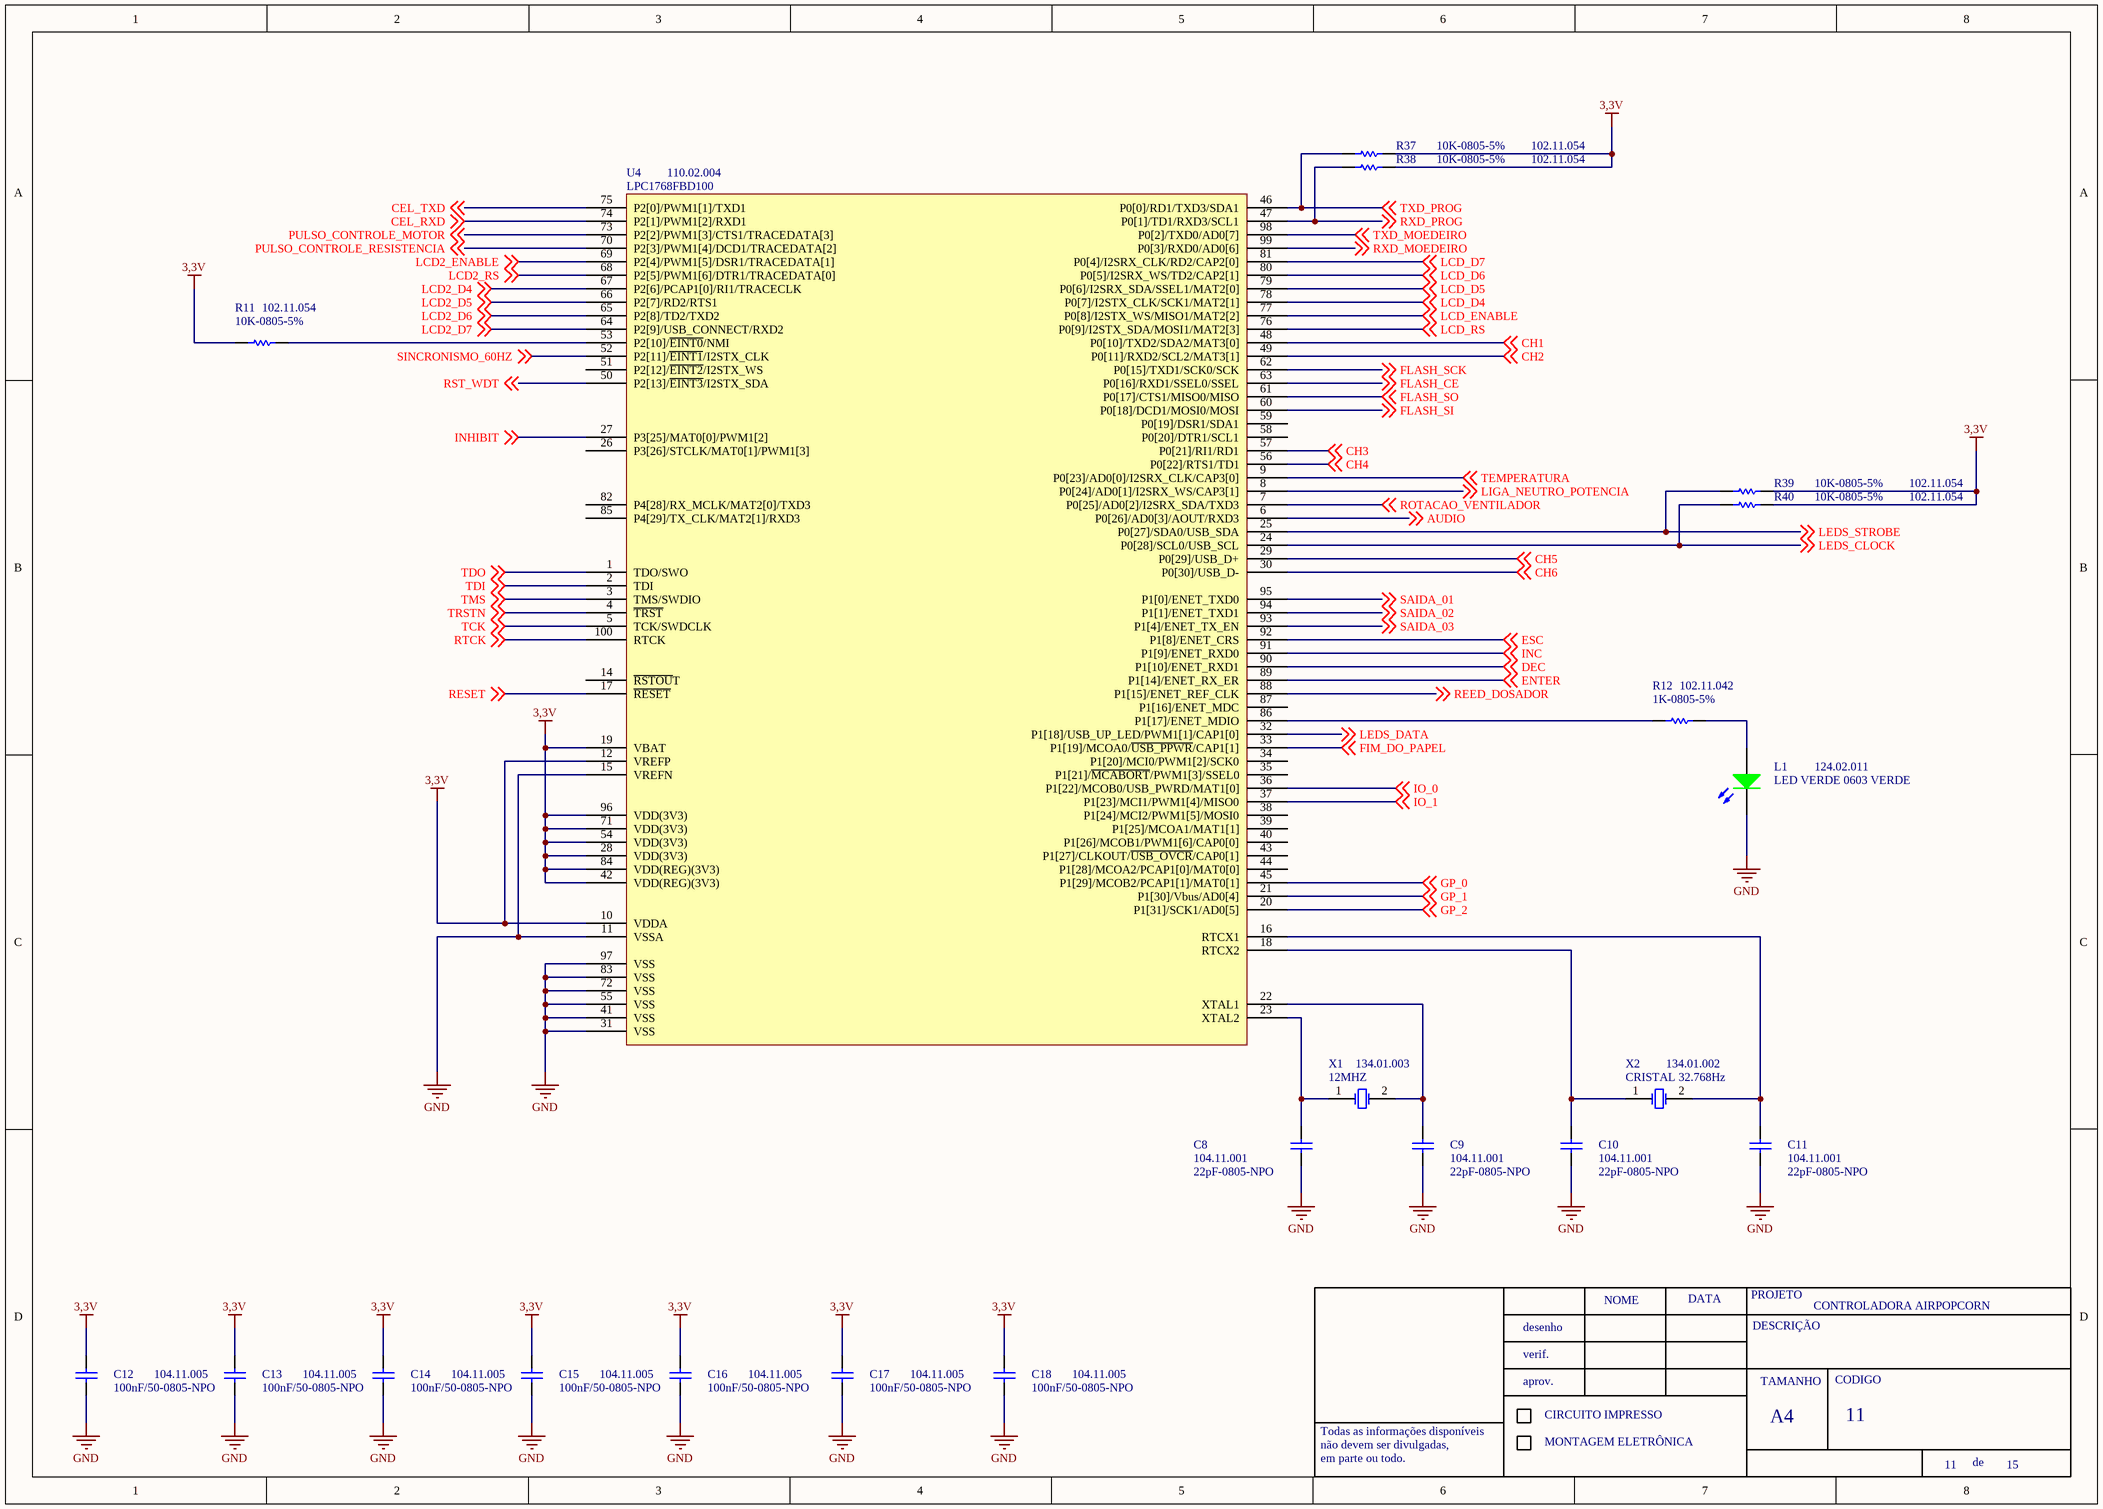
[diagram p10: CPU.SchDoc]

### Parts
C8  22pF-0805-NPO  ERP: 104.11.001  [0805-REVISADO ONDA]
C9  22pF-0805-NPO  ERP: 104.11.001  [0805-REVISADO ONDA]
C10  22pF-0805-NPO  ERP: 104.11.001  [0805-REVISADO ONDA]
C11  22pF-0805-NPO  ERP: 104.11.001  [0805-REVISADO ONDA]
C12  100nF/50-0805-NPO  ERP: 104.11.005  [0805-REVISADO ONDA]
C13  100nF/50-0805-NPO  ERP: 104.11.005  [0805-REVISADO ONDA]
C14  100nF/50-0805-NPO  ERP: 104.11.005  [0805-REVISADO ONDA]
C15  100nF/50-0805-NPO  ERP: 104.11.005  [0805-REVISADO ONDA]
C16  100nF/50-0805-NPO  ERP: 104.11.005  [0805-REVISADO ONDA]
C17  100nF/50-0805-NPO  ERP: 104.11.005  [0805-REVISADO ONDA]
C18  100nF/50-0805-NPO  ERP: 104.11.005  [0805-REVISADO ONDA]
L1  LED VERDE 0603 VERDE  ERP: 124.02.011  [LED 0805 - REVISADO ONDA]
R11  10K-0805-5%  ERP: 102.11.054  [0805-REVISADO ONDA]
R12  1K-0805-5%  ERP: 102.11.042  [0805-REVISADO ONDA]
R37  10K-0805-5%  ERP: 102.11.054  [0805-REVISADO ONDA]
R38  10K-0805-5%  ERP: 102.11.054  [0805-REVISADO ONDA]
R39  10K-0805-5%  ERP: 102.11.054  [0805-REVISADO ONDA]
R40  10K-0805-5%  ERP: 102.11.054  [0805-REVISADO ONDA]
U4  LPC1768FBD100  ERP: 110.02.004  [LQFP-100 pasta]
X1  12MHZ  ERP: 134.01.003  [CRISTAL HC49S]
X2  CRISTAL 32.768Hz  ERP: 134.01.002  [CRISTAL TH3]

### Nets
3,3V: C12.2 C13.2 C14.2 C15.2 C16.2 C17.2 C18.2 R11.1 R37.2 R38.2 R39.2 R40.2 U4.10(VDDA) U4.12(VREFP) U4.19(VBAT) U4.28(VDD(3V3)) U4.42(VDD(REG)(3V3)) U4.54(VDD(3V3)) U4.71(VDD(3V3)) U4.84(VDD(REG)(3V3)) U4.96(VDD(3V3))
GND: C8.1 C9.1 C10.1 C11.1 C12.1 C13.1 C14.1 C15.1 C16.1 C17.1 C18.1 L1.2(K) U4.11(VSSA) U4.15(VREFN) U4.31(VSS) U4.41(VSS) U4.55(VSS) U4.72(VSS) U4.83(VSS) U4.97(VSS)
AUDIO: U4.6(P0[26]/AD0[3]/AOUT/RXD3) ; off-sheet AUDIO
CEL_RXD: U4.74(P2[1]/PWM1[2]/RXD1) ; off-sheet CEL_RXD
CEL_TXD: U4.75(P2[0]/PWM1[1]/TXD1) ; off-sheet CEL_TXD
CH1: U4.48(P0[10]/TXD2/SDA2/MAT3[0]) ; off-sheet CH1
CH2: U4.49(P0[11]/RXD2/SCL2/MAT3[1]) ; off-sheet CH2
CH3: U4.57(P0[21]/RI1/RD1) ; off-sheet CH3
CH4: U4.56(P0[22]/RTS1/TD1) ; off-sheet CH4
CH5: U4.29(P0[29]/USB_D+) ; off-sheet CH5
CH6: U4.30(P0[30]/USB_D-) ; off-sheet CH6
DEC: U4.90(P1[10]/ENET_RXD1) ; off-sheet DEC
ENTER: U4.89(P1[14]/ENET_RX_ER) ; off-sheet ENTER
ESC: U4.92(P1[8]/ENET_CRS) ; off-sheet ESC
FIM_DO_PAPEL: U4.33(P1[19]/MCOA0/~{USB_PPWR}/CAP1[1]) ; off-sheet FIM_DO_PAPEL
FLASH_CE: U4.63(P0[16]/RXD1/SSEL0/SSEL) ; off-sheet FLASH_CE
FLASH_SCK: U4.62(P0[15]/TXD1/SCK0/SCK) ; off-sheet FLASH_SCK
FLASH_SI: U4.60(P0[18]/DCD1/MOSI0/MOSI) ; off-sheet FLASH_SI
FLASH_SO: U4.61(P0[17]/CTS1/MISO0/MISO) ; off-sheet FLASH_SO
GP_0: U4.45(P1[29]/MCOB2/PCAP1[1]/MAT0[1]) ; off-sheet GP_0
GP_1: U4.21(P1[30]/Vbus/AD0[4]) ; off-sheet GP_1
GP_2: U4.20(P1[31]/SCK1/AD0[5]) ; off-sheet GP_2
INC: U4.91(P1[9]/ENET_RXD0) ; off-sheet INC
INHIBIT: U4.27(P3[25]/MAT0[0]/PWM1[2]) ; off-sheet INHIBIT
IO_0: U4.36(P1[22]/MCOB0/USB_PWRD/MAT1[0]) ; off-sheet IO_0
IO_1: U4.37(P1[23]/MCI1/PWM1[4]/MISO0) ; off-sheet IO_1
LCD2_D4: U4.67(P2[6]/PCAP1[0]/RI1/TRACECLK) ; off-sheet LCD2_D4
LCD2_D5: U4.66(P2[7]/RD2/RTS1) ; off-sheet LCD2_D5
LCD2_D6: U4.65(P2[8]/TD2/TXD2) ; off-sheet LCD2_D6
LCD2_D7: U4.64(P2[9]/USB_CONNECT/RXD2) ; off-sheet LCD2_D7
LCD2_ENABLE: U4.69(P2[4]/PWM1[5]/DSR1/TRACEDATA[1]) ; off-sheet LCD2_ENABLE
LCD2_RS: U4.68(P2[5]/PWM1[6]/DTR1/TRACEDATA[0]) ; off-sheet LCD2_RS
LCD_D4: U4.78(P0[7]/I2STX_CLK/SCK1/MAT2[1]) ; off-sheet LCD_D4
LCD_D5: U4.79(P0[6]/I2SRX_SDA/SSEL1/MAT2[0]) ; off-sheet LCD_D5
LCD_D6: U4.80(P0[5]/I2SRX_WS/TD2/CAP2[1]) ; off-sheet LCD_D6
LCD_D7: U4.81(P0[4]/I2SRX_CLK/RD2/CAP2[0]) ; off-sheet LCD_D7
LCD_ENABLE: U4.77(P0[8]/I2STX_WS/MISO1/MAT2[2]) ; off-sheet LCD_ENABLE
LCD_RS: U4.76(P0[9]/I2STX_SDA/MOSI1/MAT2[3]) ; off-sheet LCD_RS
LEDS_CLOCK: R40.1 U4.24(P0[28]/SCL0/USB_SCL) ; off-sheet LEDS_CLOCK
LEDS_DATA: U4.32(P1[18]/USB_UP_LED/PWM1[1]/CAP1[0]) ; off-sheet LEDS_DATA
LEDS_STROBE: R39.1 U4.25(P0[27]/SDA0/USB_SDA) ; off-sheet LEDS_STROBE
LIGA_NEUTRO_POTENCIA: U4.8(P0[24]/AD0[1]/I2SRX_WS/CAP3[1]) ; off-sheet LIGA_NEUTRO_POTENCIA
PULSO_CONTROLE_MOTOR: U4.73(P2[2]/PWM1[3]/CTS1/TRACEDATA[3]) ; off-sheet PULSO_CONTROLE_MOTOR
PULSO_CONTROLE_RESISTENCIA: U4.70(P2[3]/PWM1[4]/DCD1/TRACEDATA[2]) ; off-sheet PULSO_CONTROLE_RESISTENCIA
REED_DOSADOR: U4.88(P1[15]/ENET_REF_CLK) ; off-sheet REED_DOSADOR
RESET: U4.17(~{RESET}) ; off-sheet RESET
ROTACAO_VENTILADOR: U4.7(P0[25]/AD0[2]/I2SRX_SDA/TXD3) ; off-sheet ROTACAO_VENTILADOR
RST_WDT: U4.50(P2[13]/~{EINT3}/I2STX_SDA) ; off-sheet RST_WDT
RTCK: U4.100(RTCK) ; off-sheet RTCK
RXD_MOEDEIRO: U4.99(P0[3]/RXD0/AD0[6]) ; off-sheet RXD_MOEDEIRO
RXD_PROG: R38.1 U4.47(P0[1]/TD1/RXD3/SCL1) ; off-sheet RXD_PROG
SAIDA_01: U4.95(P1[0]/ENET_TXD0) ; off-sheet SAIDA_01
SAIDA_02: U4.94(P1[1]/ENET_TXD1) ; off-sheet SAIDA_02
SAIDA_03: U4.93(P1[4]/ENET_TX_EN) ; off-sheet SAIDA_03
SINCRONISMO_60HZ: U4.52(P2[11]/~{EINT1}/I2STX_CLK) ; off-sheet SINCRONISMO_60HZ
TCK: U4.5(TCK/SWDCLK) ; off-sheet TCK
TDI: U4.2(TDI) ; off-sheet TDI
TDO: U4.1(TDO/SWO) ; off-sheet TDO
TEMPERATURA: U4.9(P0[23]/AD0[0]/I2SRX_CLK/CAP3[0]) ; off-sheet TEMPERATURA
TMS: U4.3(TMS/SWDIO) ; off-sheet TMS
TRSTN: U4.4(~{TRST}) ; off-sheet TRSTN
TXD_MOEDEIRO: U4.98(P0[2]/TXD0/AD0[7]) ; off-sheet TXD_MOEDEIRO
TXD_PROG: R37.1 U4.46(P0[0]/RD1/TXD3/SDA1) ; off-sheet TXD_PROG
NetC8_2: C8.2 U4.23(XTAL2) X1.1(OSC1)
NetC9_2: C9.2 U4.22(XTAL1) X1.2(OSC2)
NetC10_2: C10.2 U4.18(RTCX2) X2.1(OSC1)
NetC11_2: C11.2 U4.16(RTCX1) X2.2(OSC2)
NetL1_1: L1.1(A) R12.2
NetR11_2: R11.2 U4.53(P2[10]/~{EINT0}/NMI)
NetR12_1: R12.1 U4.86(P1[17]/ENET_MDIO)

Not connected (* = marked no-connect by the designer): U4 14(~{RSTOU}T) 26(P3[26]/STCLK/MAT0[1]/PWM1[3]) 34(P1[20]/MCI0/PWM1[2]/SCK0) 35(P1[21]/~{MCABORT}/PWM1[3]/SSEL0) 38(P1[24]/MCI2/PWM1[5]/MOSI0) 39(P1[25]/MCOA1/MAT1[1]) 40(P1[26]/MCOB1/PWM1[6]/CAP0[0]) 43(P1[27]/CLKOUT/~{USB_OVCR}/CAP0[1]) 44(P1[28]/MCOA2/PCAP1[0]/MAT0[0]) 51(P2[12]/~{EINT2}/I2STX_WS) 58(P0[20]/DTR1/SCL1) 59(P0[19]/DSR1/SDA1) 82(P4[28]/RX_MCLK/MAT2[0]/TXD3) 85(P4[29]/TX_CLK/MAT2[1]/RXD3) 87(P1[16]/ENET_MDC)

### Notes on the sheet
- NOME
- DATA
- PROJETO
- DESCRIÇÃO
- desenho
- verif.
- aprov.
- TAMANHO
- CODIGO
- Todas as informações disponíveis
- não devem ser divulgadas,
- em parte ou todo.
- CIRCUITO IMPRESSO
- MONTAGEM ELETRÔNICA
- A4
- de

### Library data of the parts
L1 = LED VERDE 0603 SMD
U4 = LPC1768FDB100
X1 = CRISTAL 12MHZ
X2 = CRISTAL 32.768 Hz

## Sheet Memoria.SchDoc: CONTROLADORA AIRPOPCORN
size A3; DocumentNumber: 12; SheetNumber: 12; SheetTotal: 15
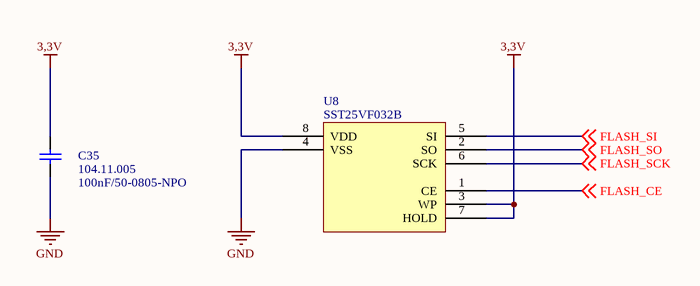
[diagram p11: Memoria.SchDoc]

### Parts
C35  100nF/50-0805-NPO  ERP: 104.11.005  [0805-REVISADO ONDA]
U8  SST25VF032B  [SOIC-08]

### Nets
3,3V: C35.2 U8.3(WP) U8.7(HOLD) U8.8(VDD)
GND: C35.1 U8.4(VSS)
FLASH_CE: U8.1(CE) ; off-sheet FLASH_CE
FLASH_SCK: U8.6(SCK) ; off-sheet FLASH_SCK
FLASH_SI: U8.5(SI) ; off-sheet FLASH_SI
FLASH_SO: U8.2(SO) ; off-sheet FLASH_SO

### Notes on the sheet
- NOME
- DATA
- PROJETO
- DESCRIÇÃO
- desenho
- verif.
- aprov.
- TAMANHO
- CODIGO
- Todas as informações disponíveis
- não devem ser divulgadas,
- em parte ou todo.
- CIRCUITO IMPRESSO
- MONTAGEM ELETRÔNICA
- A4
- de

### Library data of the parts
U8 = SST25VF032B: ERP: FALTA CADASTRAR

## Sheet JTAG.SchDoc: CONTROLADORA AIRPOPCORN
size A3; DocumentNumber: 13; SheetNumber: 13; SheetTotal: 15
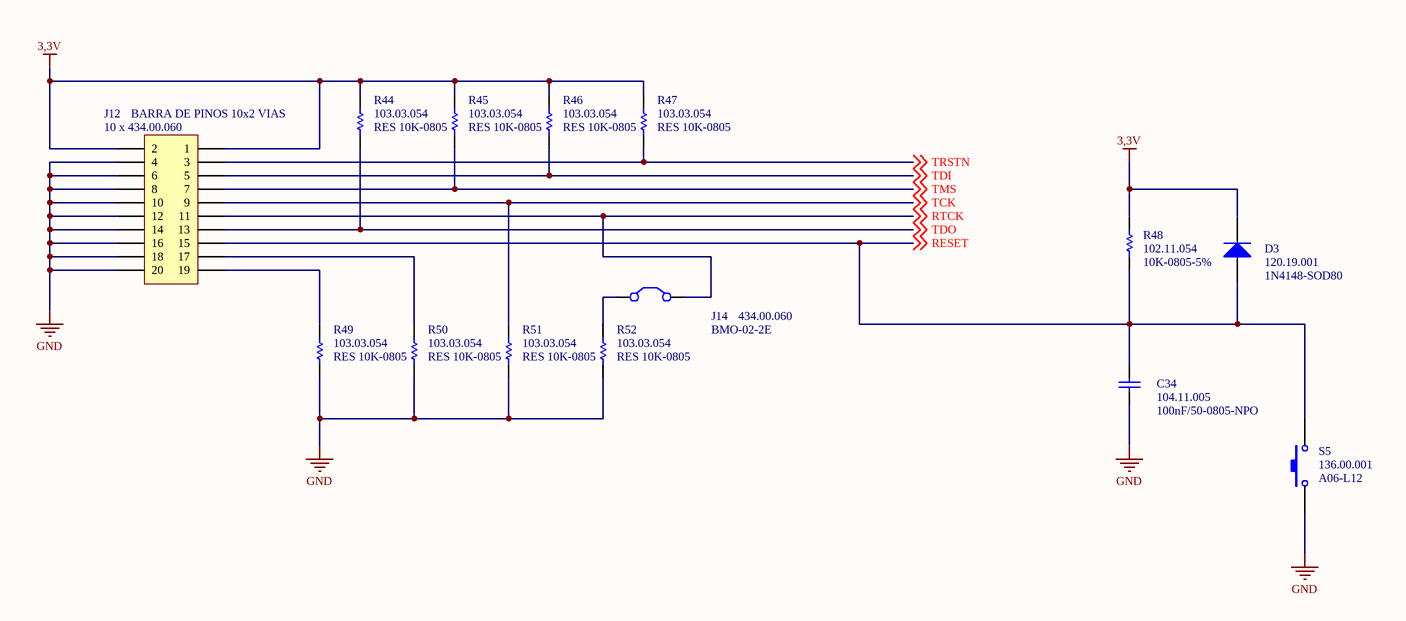
[diagram p12: JTAG.SchDoc]

### Parts
C34  100nF/50-0805-NPO  ERP: 104.11.005  [0805-REVISADO ONDA]
D3  1N4148-SOD80  ERP: 120.19.001  [MINIMLEF/SOD80 - REVISADO ONDA]
J12  BARRA DE PINOS 10x2 VIAS  ERP: 10 x 434.00.060  [IDCSC-20]
J14  BMO-02-2E  ERP: 434.00.060  [JUMPER100]
R44  RES 10K-0805  ERP: 103.03.054  [0805-REVISADO ONDA]
R45  RES 10K-0805  ERP: 103.03.054  [0805-REVISADO ONDA]
R46  RES 10K-0805  ERP: 103.03.054  [0805-REVISADO ONDA]
R47  RES 10K-0805  ERP: 103.03.054  [0805-REVISADO ONDA]
R48  10K-0805-5%  ERP: 102.11.054  [0805-REVISADO ONDA]
R49  RES 10K-0805  ERP: 103.03.054  [0805-REVISADO ONDA]
R50  RES 10K-0805  ERP: 103.03.054  [0805-REVISADO ONDA]
R51  RES 10K-0805  ERP: 103.03.054  [0805-REVISADO ONDA]
R52  RES 10K-0805  ERP: 103.03.054  [0805-REVISADO ONDA]
S5  A06-L12  ERP: 136.00.001  [chave tactil nova]

### Nets
3,3V: D3.2 J12.1 J12.2 R44.1 R45.1 R46.1 R47.1 R48.2
GND: C34.1 J12.4 J12.6 J12.8 J12.10 J12.12 J12.14 J12.16 J12.18 J12.20 R49.2 R50.2 R51.2 R52.2 S5.1
RESET: C34.2 D3.1 J12.15 R48.1 S5.2 ; off-sheet RESET
RTCK: J12.11 J14.2(C2) ; off-sheet RTCK
TCK: J12.9 R51.1 ; off-sheet TCK
TDI: J12.5 R46.2 ; off-sheet TDI
TDO: J12.13 R44.2 ; off-sheet TDO
TMS: J12.7 R45.2 ; off-sheet TMS
TRSTN: J12.3 R47.2 ; off-sheet TRSTN
NetJ12_17: J12.17 R50.1
NetJ12_19: J12.19 R49.1
NetJ14_1: J14.1(C1) R52.1

### Notes on the sheet
- NOME
- DATA
- PROJETO
- DESCRIÇÃO
- desenho
- verif.
- aprov.
- TAMANHO
- CODIGO
- Todas as informações disponíveis
- não devem ser divulgadas,
- em parte ou todo.
- CIRCUITO IMPRESSO
- MONTAGEM ELETRÔNICA
- A4
- de

### Library data of the parts
J12 = HEADER 10x2
J14 = BARRA DE PINOS

## Sheet InterfaceGSM.SchDoc: CONTROLADORA AIRPOPCORN
size A3; DocumentNumber: 14; SheetNumber: 14; SheetTotal: 15
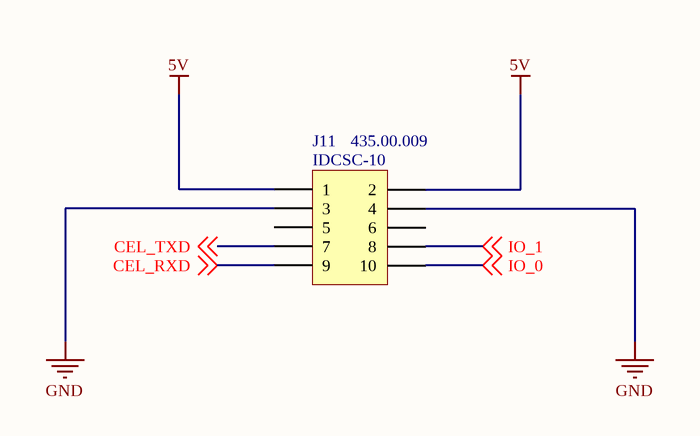
[diagram p13: InterfaceGSM.SchDoc]

### Parts
J11  IDCSC-10  ERP: 435.00.009  [IDCSC-10]

### Nets
5V: J11.1 J11.2
GND: J11.3 J11.4
CEL_RXD: J11.9 ; off-sheet CEL_RXD
CEL_TXD: J11.7 ; off-sheet CEL_TXD
IO_0: J11.10 ; off-sheet IO_0
IO_1: J11.8 ; off-sheet IO_1

Not connected (* = marked no-connect by the designer): J11 5 6

### Notes on the sheet
- NOME
- DATA
- PROJETO
- DESCRIÇÃO
- desenho
- verif.
- aprov.
- TAMANHO
- CODIGO
- Todas as informações disponíveis
- não devem ser divulgadas,
- em parte ou todo.
- CIRCUITO IMPRESSO
- MONTAGEM ELETRÔNICA
- A4
- de

### Library data of the parts
J11 = IDCSN: CONECTOR HEADER 10 VIAS 90º

## Sheet InterfacePagamentos.SchDoc: CONTROLADORA AIRPOPCORN
size A3; DocumentNumber: 15; SheetNumber: 15; SheetTotal: 15
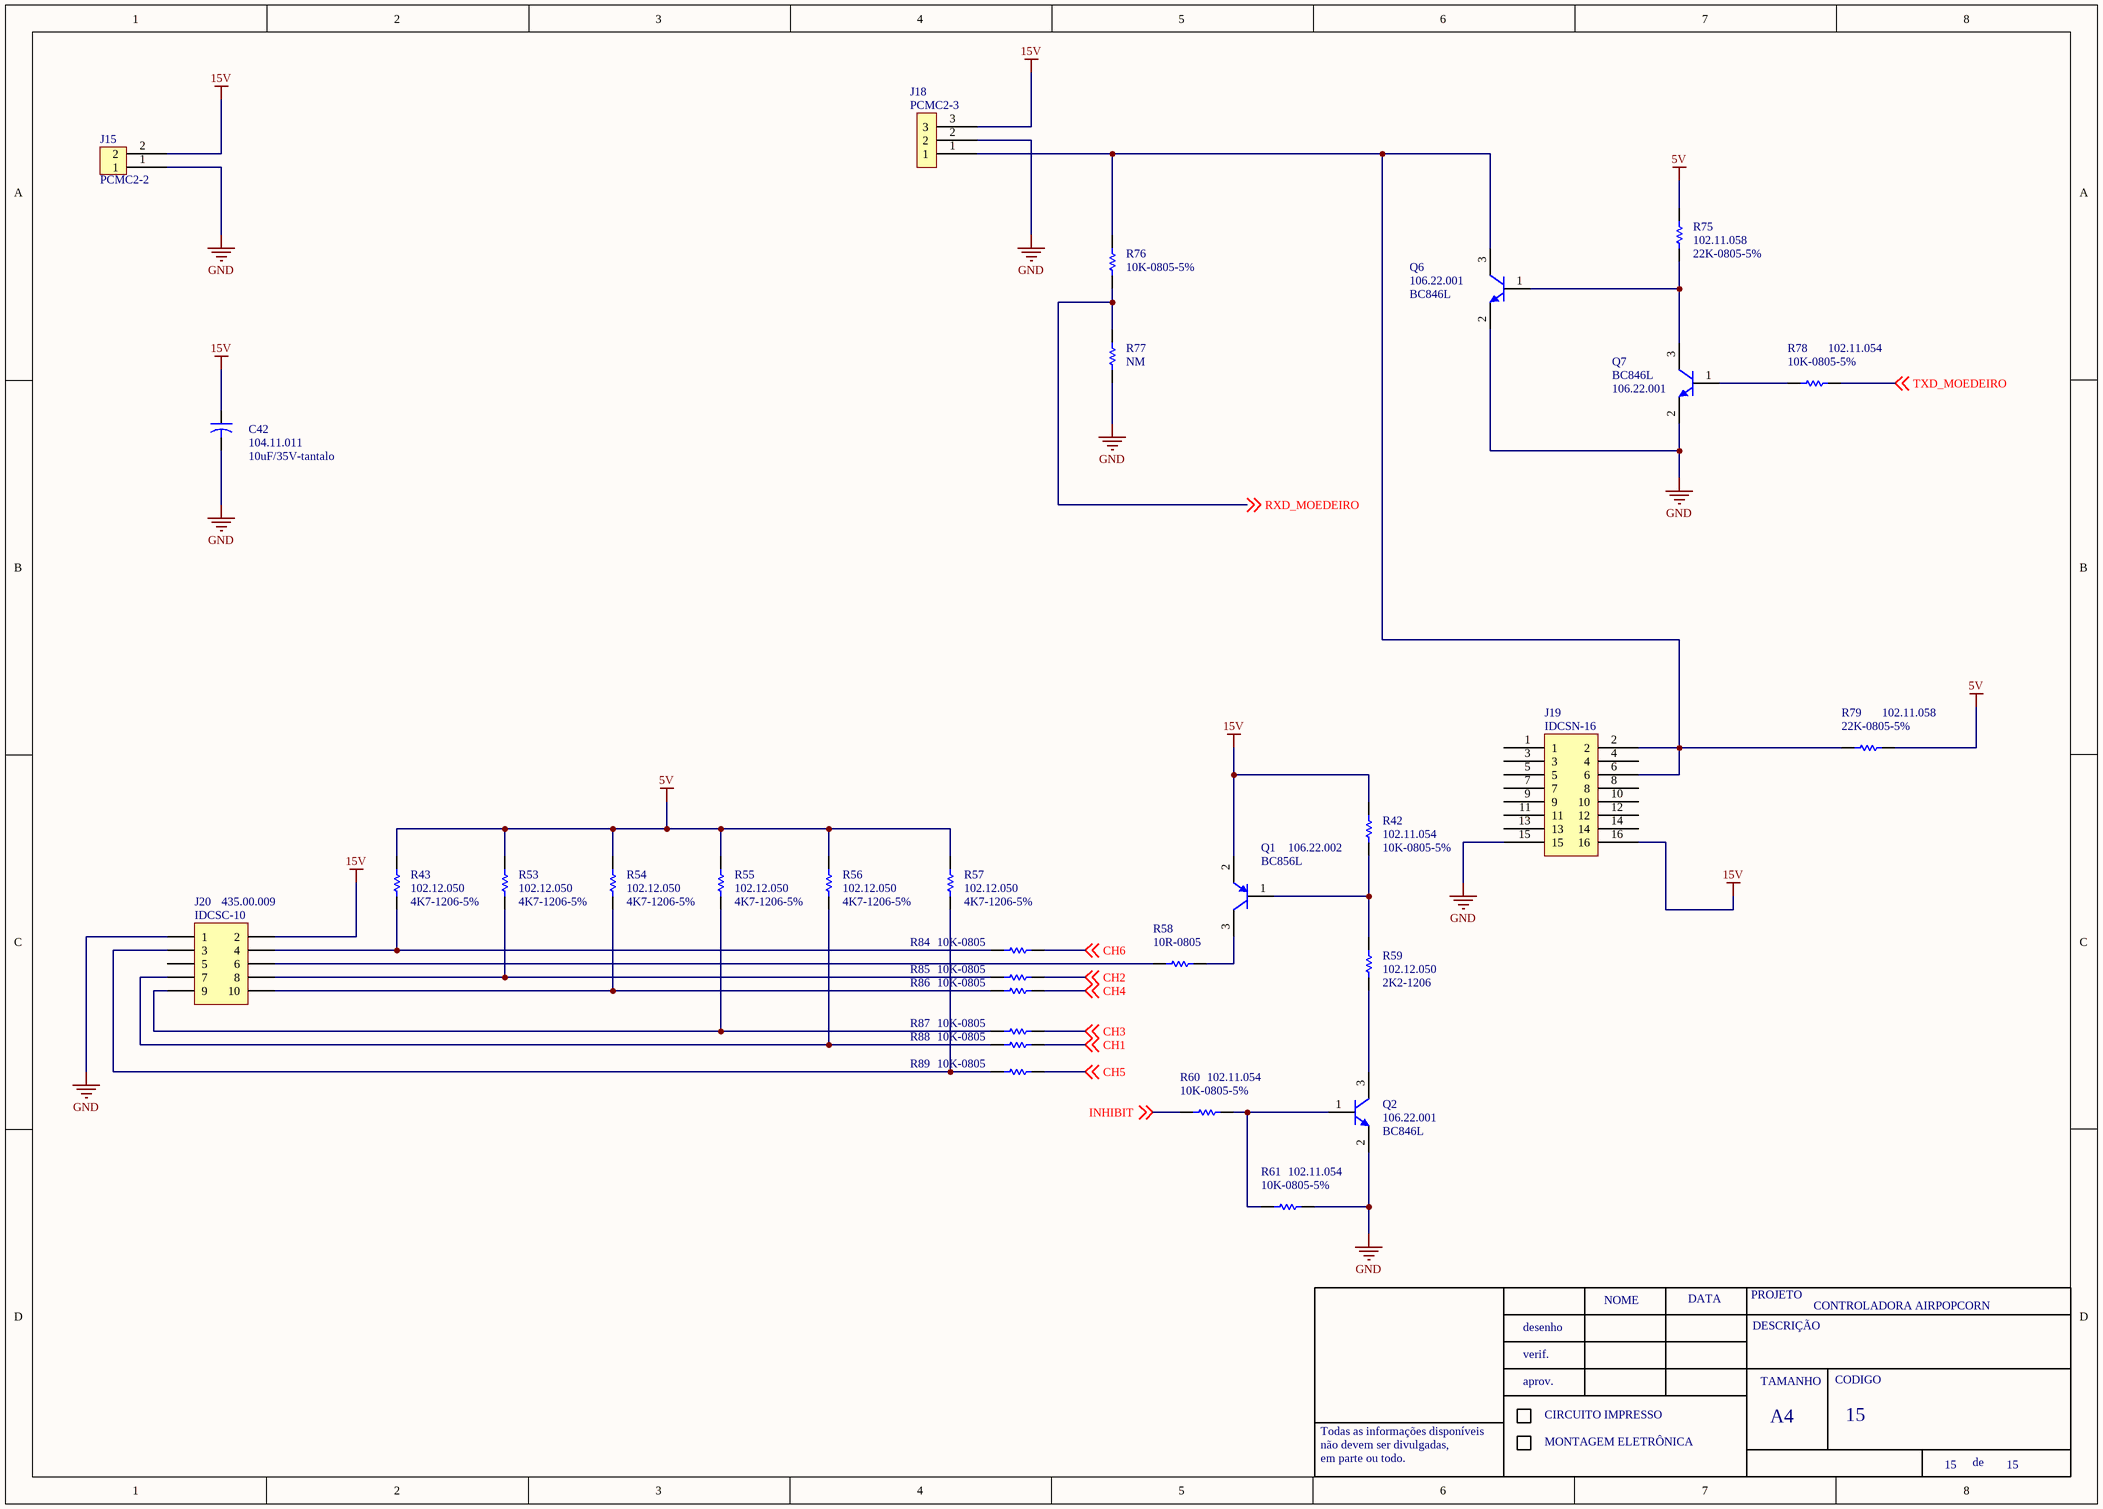
[diagram p14: InterfacePagamentos.SchDoc]

### Parts
C42  10uF/35V-tantalo  ERP: 104.11.011  [CAP 2413 POLARIZADO KEMET]
J15  PCMC2-2  [PCMC2-2]
J18  PCMC2-3  [PCMC2-3]
J19  IDCSN-16  [IDCSC-16]
J20  IDCSC-10  ERP: 435.00.009  [IDCSC-10]
Q1  BC856L  ERP: 106.22.002  [SOT23 - REVISADO ONDA]
Q2  BC846L  ERP: 106.22.001  [SOT23 - REVISADO ONDA]
Q6  BC846L  ERP: 106.22.001  [SOT23 - REVISADO ONDA]
Q7  BC846L  ERP: 106.22.001  [SOT23 - REVISADO ONDA]
R42  10K-0805-5%  ERP: 102.11.054  [0805-REVISADO ONDA]
R43  4K7-1206-5%  ERP: 102.12.050  [0805-REVISADO ONDA]
R53  4K7-1206-5%  ERP: 102.12.050  [0805-REVISADO ONDA]
R54  4K7-1206-5%  ERP: 102.12.050  [0805-REVISADO ONDA]
R55  4K7-1206-5%  ERP: 102.12.050  [0805-REVISADO ONDA]
R56  4K7-1206-5%  ERP: 102.12.050  [0805-REVISADO ONDA]
R57  4K7-1206-5%  ERP: 102.12.050  [0805-REVISADO ONDA]
R58  10R-0805  [1206-REVISADO ONDA]
R59  2K2-1206  ERP: 102.12.050  [0805-REVISADO ONDA]
R60  10K-0805-5%  ERP: 102.11.054  [0805-REVISADO ONDA]
R61  10K-0805-5%  ERP: 102.11.054  [0805-REVISADO ONDA]
R75  22K-0805-5%  ERP: 102.11.058  [0805-REVISADO ONDA]
R76  10K-0805-5%  [0805-REVISADO ONDA]
R77  NM  [0805-REVISADO ONDA]
R78  10K-0805-5%  ERP: 102.11.054  [0805-REVISADO ONDA]
R79  22K-0805-5%  ERP: 102.11.058  [0805-REVISADO ONDA]
R84  10K-0805  [1206-REVISADO ONDA]
R85  10K-0805  [1206-REVISADO ONDA]
R86  10K-0805  [1206-REVISADO ONDA]
R87  10K-0805  [1206-REVISADO ONDA]
R88  10K-0805  [1206-REVISADO ONDA]
R89  10K-0805  [1206-REVISADO ONDA]

### Nets
5V: R43.2 R53.2 R54.2 R55.2 R56.2 R57.2 R75.2 R79.2
15V: C42.1 J15.2 J18.3 J19.16 J20.2 Q1.2(E) R42.2
GND: C42.2 J15.1 J18.2 J19.15 J20.1 Q2.2(E) Q6.2(E) Q7.2(E) R61.2 R77.1
CH1: R88.1 ; off-sheet CH1
CH2: R85.1 ; off-sheet CH2
CH3: R87.1 ; off-sheet CH3
CH4: R86.1 ; off-sheet CH4
CH5: R89.1 ; off-sheet CH5
CH6: R84.1 ; off-sheet CH6
INHIBIT: R60.1 ; off-sheet INHIBIT
RXD_MOEDEIRO: R76.2 R77.2 ; off-sheet RXD_MOEDEIRO
TXD_MOEDEIRO: R78.2 ; off-sheet TXD_MOEDEIRO
NetJ18_1: J18.1 J19.2 J19.6 Q6.3(C) R76.1 R79.1
NetJ20_3: J20.3 R57.1 R89.2
NetJ20_4: J20.4 R43.1 R84.2
NetJ20_6: J20.6 R58.2
NetJ20_7: J20.7 R56.1 R88.2
NetJ20_8: J20.8 R53.1 R85.2
NetJ20_9: J20.9 R55.1 R87.2
NetJ20_10: J20.10 R54.1 R86.2
NetQ1_1: Q1.1(B) R42.1 R59.2
NetQ1_3: Q1.3(C) R58.1
NetQ2_1: Q2.1(B) R60.2 R61.1
NetQ2_3: Q2.3(C) R59.1
NetQ6_1: Q6.1(B) Q7.3(C) R75.1
NetQ7_1: Q7.1(B) R78.1

Not connected (* = marked no-connect by the designer): J19 1 3 4 5 7 8 9 10 11 12 13 14; J20 5

### Notes on the sheet
- NOME
- DATA
- PROJETO
- DESCRIÇÃO
- desenho
- verif.
- aprov.
- TAMANHO
- CODIGO
- Todas as informações disponíveis
- não devem ser divulgadas,
- em parte ou todo.
- CIRCUITO IMPRESSO
- MONTAGEM ELETRÔNICA
- A4
- de

### Library data of the parts
J20 = IDCSN: CONECTOR HEADER 10 VIAS 90º
Q2 Q6 Q7 = BC846
R58 R84-R89 = 10K-0805-5%: ERP: 102.11.054
R59 = 4K7-1206-5%
R76 = 56K-0805-5%: ERP: 102.11.063
R77 = 100K-0805-5%: ERP: 102.11.066

## Nets that join several sheets
3,3V: Regulador (5 pins), SaidasMotoresCC (J22.1 R69.2), InterfaceConfiguracao (C27.2 J5.3 U6.16), IHM (R25.1 R26.1 R27.1 R28.1), EntradaSensores (5 pins), EntradaSensorTemperatura (J8.2), CPU (21 pins), Memoria (C35.2 U8.3 U8.7 U8.8), JTAG (8 pins)
5V: Regulador (5 pins), ControleLeds (6 pins), SaidasMotoresCC (R13.2), InterfaceConfiguracao (J5.1), IHM (12 pins), EntradaSensores (R67.2), InterfaceGSM (J11.1 J11.2), InterfacePagamentos (8 pins)
12V: Regulador (C37.1 D1.2 PSW4.2), ControleLeds (J2.9 J9.9), SaidasMotoresCC (J21.3 J22.4), EntradaSensores (R15.1)
GND: Regulador (11 pins), ControleLeds (10 pins), SaidasMotoresCC (10 pins), InterfaceConfiguracao (6 pins), IHM (22 pins), amplificadorAudio (10 pins), EntradaSensores (7 pins), EntradaSensorTemperatura (C22.1 R24.1), ControlePotencia (J3.1), CPU (20 pins), Memoria (C35.1 U8.4), JTAG (15 pins), InterfaceGSM (J11.3 J11.4), InterfacePagamentos (10 pins)
AUDIO: amplificadorAudio (R1.1), CPU (U4.6)
CEL_RXD: CPU (U4.74), InterfaceGSM (J11.9)
CEL_TXD: CPU (U4.75), InterfaceGSM (J11.7)
CH1: CPU (U4.48), InterfacePagamentos (R88.1)
CH2: CPU (U4.49), InterfacePagamentos (R85.1)
CH3: CPU (U4.57), InterfacePagamentos (R87.1)
CH4: CPU (U4.56), InterfacePagamentos (R86.1)
CH5: CPU (U4.29), InterfacePagamentos (R89.1)
CH6: CPU (U4.30), InterfacePagamentos (R84.1)
DEC: IHM (R27.2 S3.2), CPU (U4.90)
ENTER: IHM (R28.2 S4.2), CPU (U4.89)
ESC: IHM (R25.2 S1.2), CPU (U4.92)
FIM_DO_PAPEL: SaidasMotoresCC (C33.2 R70.2), CPU (U4.33)
FLASH_CE: CPU (U4.63), Memoria (U8.1)
FLASH_SCK: CPU (U4.62), Memoria (U8.6)
FLASH_SI: CPU (U4.60), Memoria (U8.5)
FLASH_SO: CPU (U4.61), Memoria (U8.2)
GP_0: EntradaSensores (R20.2), CPU (U4.45)
GP_1: EntradaSensores (R21.2), CPU (U4.21)
GP_2: EntradaSensores (R22.2), CPU (U4.20)
INC: IHM (R26.2 S2.2), CPU (U4.91)
INHIBIT: CPU (U4.27), InterfacePagamentos (R60.1)
IO_0: CPU (U4.36), InterfaceGSM (J11.10)
IO_1: CPU (U4.37), InterfaceGSM (J11.8)
LCD2_D4: IHM (U5.4), CPU (U4.67)
LCD2_D5: IHM (U5.5), CPU (U4.66)
LCD2_D6: IHM (U5.6), CPU (U4.65)
LCD2_D7: IHM (U5.7), CPU (U4.64)
LCD2_ENABLE: IHM (U5.3), CPU (U4.69)
LCD2_RS: IHM (U5.2), CPU (U4.68)
LCD_D4: IHM (R34.2), CPU (U4.78)
LCD_D5: IHM (R32.2), CPU (U4.79)
LCD_D6: IHM (R31.2), CPU (U4.80)
LCD_D7: IHM (R30.2), CPU (U4.81)
LCD_ENABLE: IHM (LCD1.6), CPU (U4.77)
LCD_RS: IHM (LCD1.4), CPU (U4.76)
LEDS_CLOCK: ControleLeds (U2.11 U7.11), CPU (R40.1 U4.24)
LEDS_DATA: ControleLeds (U2.14), CPU (U4.32)
LEDS_STROBE: ControleLeds (U2.12 U7.12), CPU (R39.1 U4.25)
LIGA_NEUTRO_POTENCIA: ControlePotencia (R10.1), CPU (U4.8)
PULSO_CONTROLE_MOTOR: ControlePotencia (R8.1), CPU (U4.73)
PULSO_CONTROLE_RESISTENCIA: ControlePotencia (R7.1), CPU (U4.70)
REED_DOSADOR: SaidasMotoresCC (C19.2 R14.2), CPU (U4.88)
RESET: CPU (U4.17), JTAG (5 pins)
ROTACAO_VENTILADOR: EntradaSensores (C21.2 R16.2), CPU (U4.7)
RTCK: CPU (U4.100), JTAG (J12.11 J14.2)
RXD_MOEDEIRO: CPU (U4.99), InterfacePagamentos (R76.2 R77.2)
RXD_PROG: InterfaceConfiguracao (U6.12), CPU (R38.1 U4.47)
SINCRONISMO_60HZ: ControlePotencia (R9.1), CPU (U4.52)
TCK: CPU (U4.5), JTAG (J12.9 R51.1)
TDI: CPU (U4.2), JTAG (J12.5 R46.2)
TDO: CPU (U4.1), JTAG (J12.13 R44.2)
TEMPERATURA: EntradaSensorTemperatura (R23.2), CPU (U4.9)
TMS: CPU (U4.3), JTAG (J12.7 R45.2)
TRSTN: CPU (U4.4), JTAG (J12.3 R47.2)
TXD_MOEDEIRO: CPU (U4.98), InterfacePagamentos (R78.2)
TXD_PROG: InterfaceConfiguracao (U6.11), CPU (R37.1 U4.46)